# EasyEDA Pro project mini-link.eprj

# Schematic Schematic1
Create Date: 2022-12-03; Page Name: MCU; Project Name: GD32F103-DAP; Schematic Name: Schematic1; Update Date: 2023-03-23; Company: 嘉立创EDA; Page Size: A4; Version: V1.0
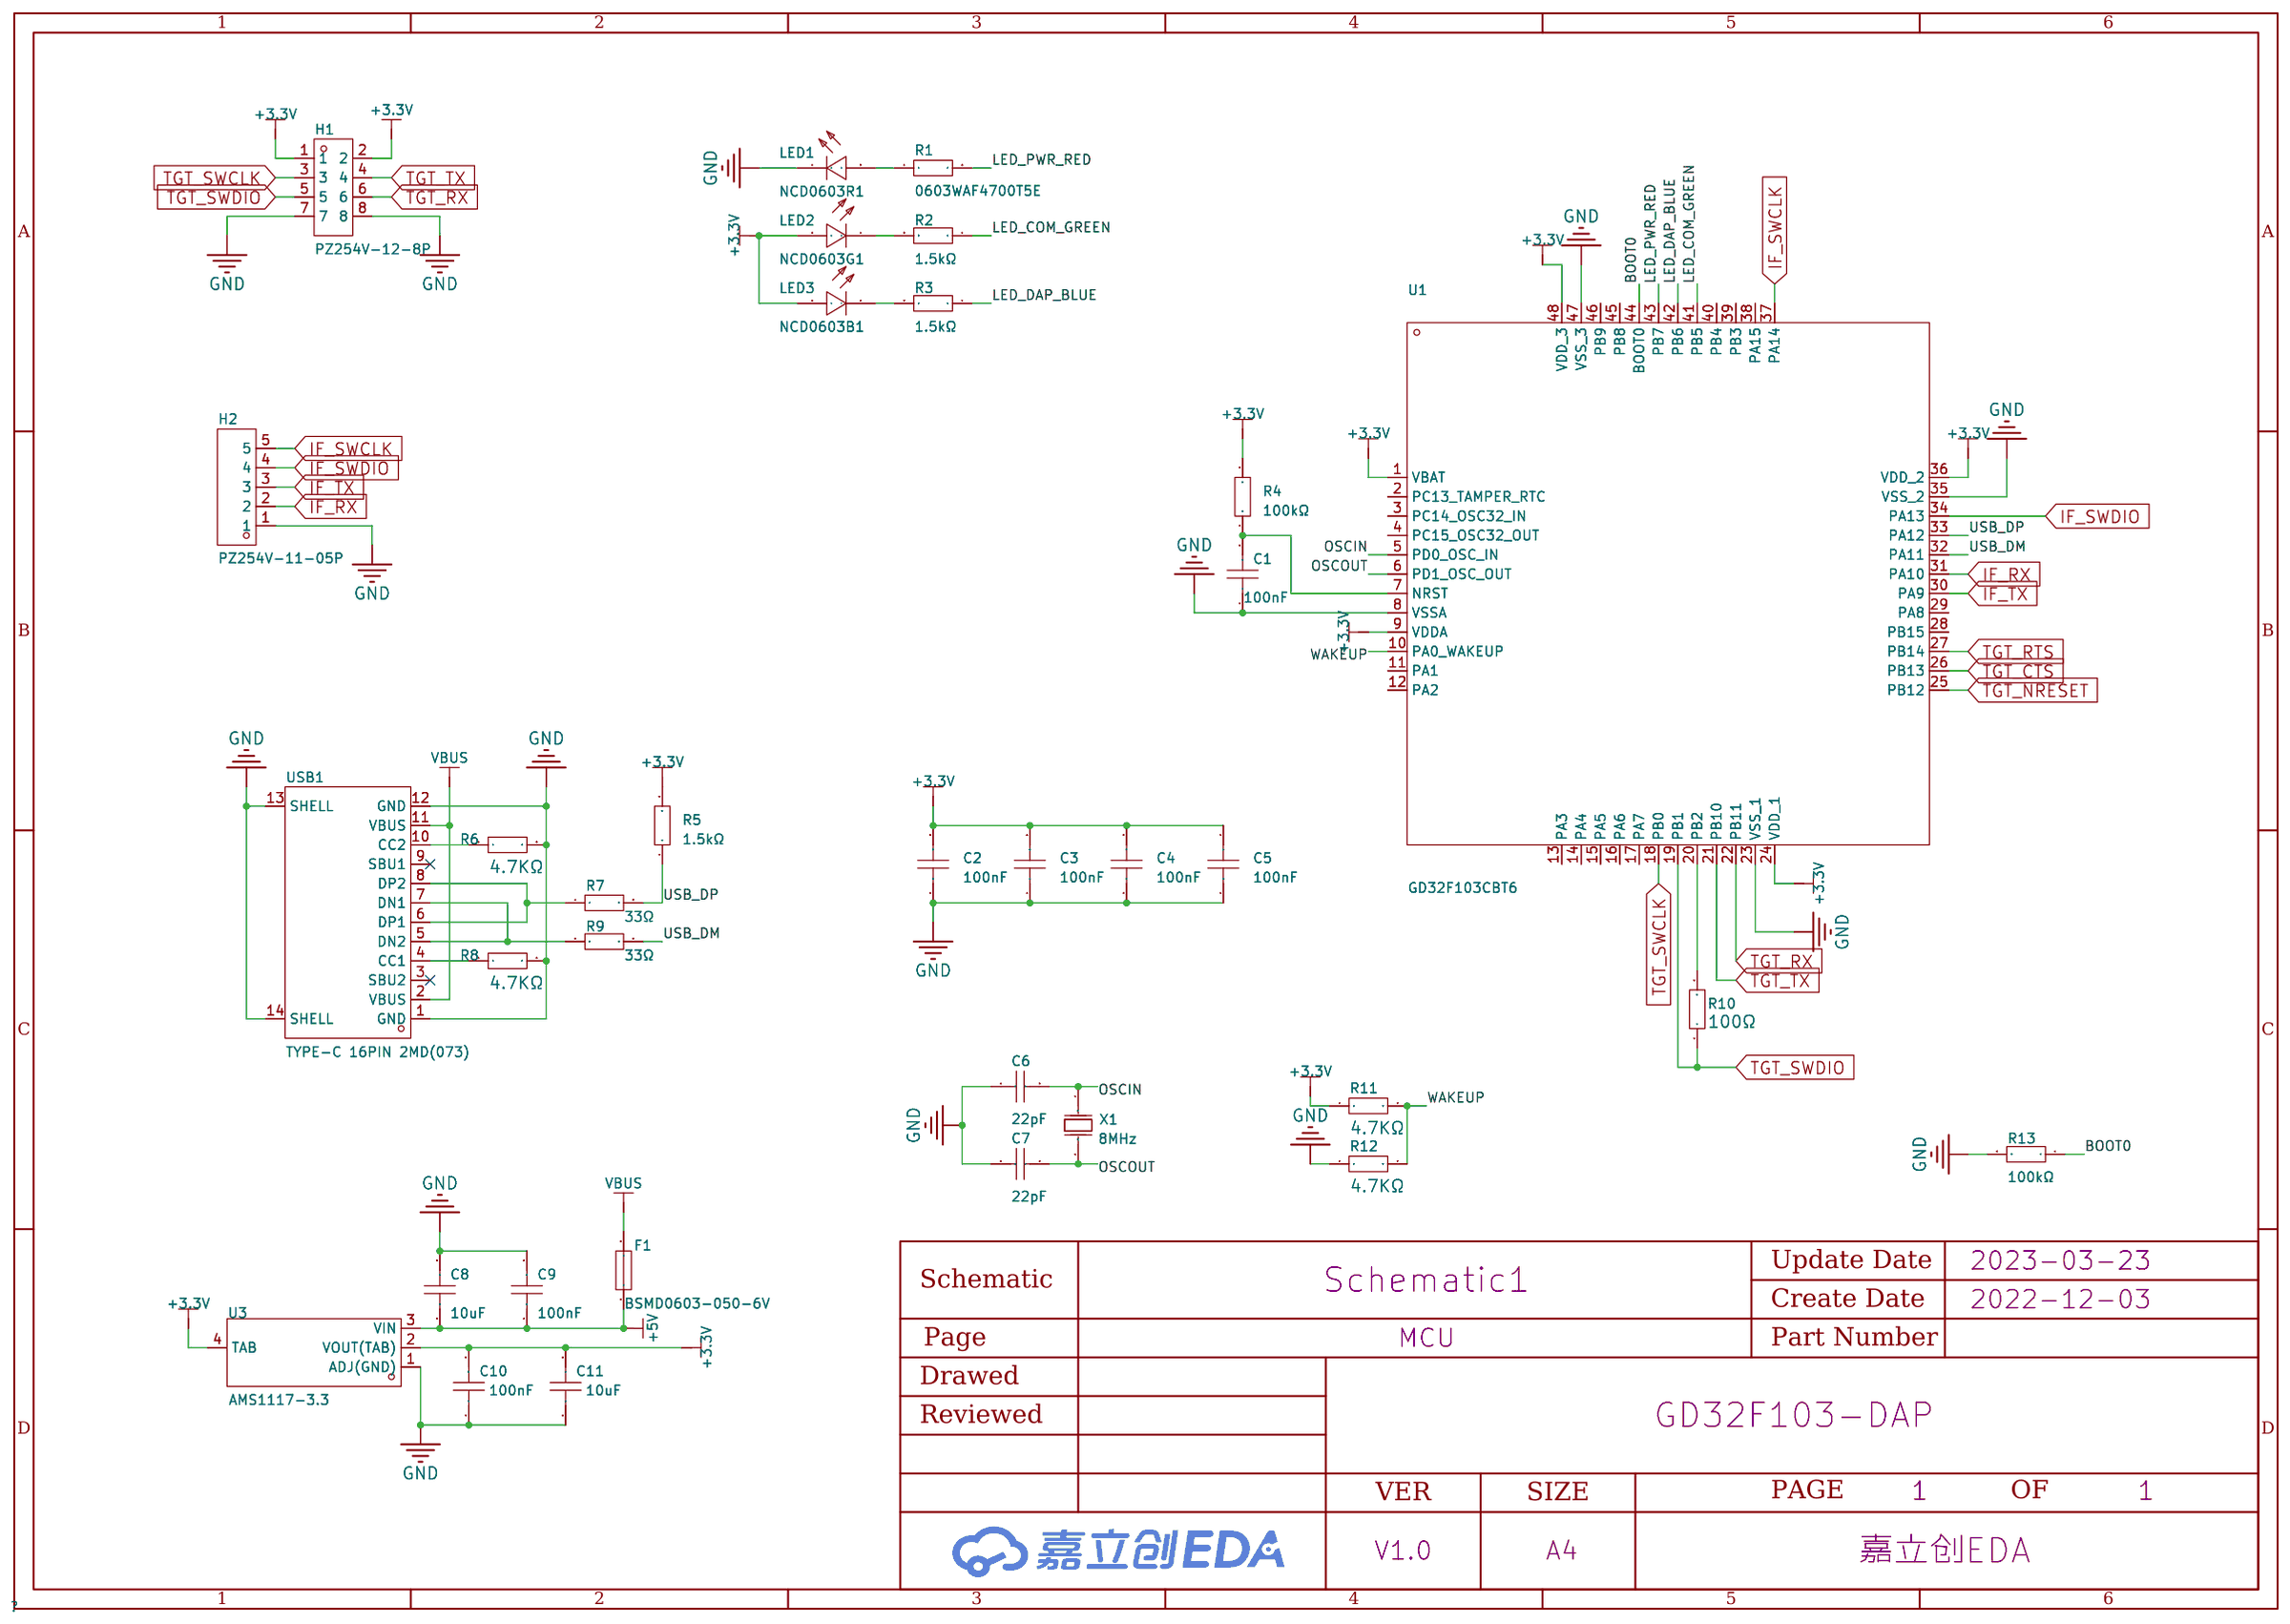
[diagram p0: schematic sheet]

## Parts
C1  100nF  [C0603]
C2  100nF  [C0603]
C3  100nF  [C0603]
C4  100nF  [C0603]
C5  100nF  [C0603]
C6  22pF  [C0603]
C7  22pF  [C0603]
C8  10uF  [C0603]
C9  100nF  [C0603]
C10  100nF  [C0603]
C11  10uF  [C0603]
F1  BSMD0603-050-6V  [F0603]
H1  PZ254V-12-8P  [HDR-TH_8P-P2.54-V-M-R2-C4-S2.54]
H2  PZ254V-11-05P  [HDR-TH_5P-P2.54-V-M]
LED1  NCD0603R1  [LED0603-RD_RED]
LED2  NCD0603G1  [LED0603-RD]
LED3  NCD0603B1  [LED0603-RD]
R1  470Ω  [R0603]
R2  1.5kΩ  [R0603]
R3  1.5kΩ  [R0603]
R4  100kΩ  [R0603]
R5  1.5kΩ  [R0603]
R6  4.7KΩ  [R0603]
R7  33Ω  [R0603]
R8  4.7KΩ  [R0603]
R9  33Ω  [R0603]
R10  100Ω  [R0603]
R11  4.7KΩ  [R0603]
R12  4.7KΩ  [R0603]
R13  100kΩ  [R0603]
U1  GD32F103CBT6  [LQFP-48_L7.0-W7.0-P0.50-LS9.0-BL]
U3  AMS1117-3.3  [SOT-223-4_L6.5-W3.5-P2.30-LS7.0-BR]
USB1  TYPE-C 16PIN 2MD(073)  [USB-C-SMD_TYPE-C-6PIN-2MD-073]
X1  8MHz  [CRYSTAL-SMD_L11.5-W4.8-LS12.7]

## Library data of the parts
C1-C5 C9 C10 = CC0603KRX7R9BB104: 容值:100nF;精度:±10%;额定电压:50V;材质(温度系数):X7R;; LCSC Part Name: 100nF ±10% 50V; Supplier Part: C14663; Manufacturer: YAGEO(国巨); Supplier Footprint: 0603; JLCPCB Part Class: Basic Part; Datasheet: https://atta.szlcsc.com/upload/public/pdf/source/20170116/1484561234239.pdf; Supplier: LCSC; Tolerance: ±10%; Voltage Rated: 50V; Temperature Coefficient: X7R
C6 C7 = CC0603JRNPO9BN220: 容值:22pF;精度:±5%;额定电压:50V;材质(温度系数):NP0;; LCSC Part Name: 22pF ±5% 50V; Supplier Part: C105620; Manufacturer: YAGEO(国巨); Supplier Footprint: 0603; JLCPCB Part Class: Extended Part; Datasheet: https://atta.szlcsc.com/upload/public/pdf/source/20170425/1493115771353.pdf; Supplier: LCSC; Tolerance: ±5%; Voltage Rated: 50V; Temperature Coefficient: NP0
C8 C11 = CL10A106KP8NNNC: 容值:10uF;精度:±10%;额定电压:10V;材质(温度系数):X5R;; LCSC Part Name: 10uF ±10% 10V; Supplier Part: C19702; Manufacturer: SAMSUNG(三星); Supplier Footprint: 0603; JLCPCB Part Class: Basic Part; Datasheet: https://atta.szlcsc.com/upload/public/pdf/source/20160103/1457707703378.pdf; Supplier: LCSC; Tolerance: ±10%; Voltage Rated: 10V; Temperature Coefficient: X5R
F1 = BSMD0603-050-6V: 最大电压:6V;最大电流:40A;保持电流:500mA;跳闸电流:1A;消耗功率:500mW;初始态阻值(最小值):100mΩ;跳断后阻值(最大值):800mΩ;最大动作时间:100ms;工作温度:-40~+85;; LCSC Part Name: 国产自恢复 0603 0.5A 6V; Supplier Part: C883095; Manufacturer: BHFUSE(佰宏); Supplier Footprint: 0603; JLCPCB Part Class: Extended Part; Datasheet: https://atta.szlcsc.com/upload/public/pdf/source/20220302/2A4AFA61964160B34367BDE2745D6217.pdf; Supplier: LCSC; Operating Voltage (Max): 6V; Current Rating (Max): 40A; Hold Current: 500mA; Trip Current: 1A; Power Dissipation: 500mW; Resistance - Initial (Ri) (Min): 100mΩ; Resistance - Post Trip (R1) (Max): 800mΩ; Maximum Time to Trip: 100ms; Operating Temperature: -40~+85
H1 = PZ254V-12-8P: 间距:2.54mm;总PIN位数:8;排数:2;插针结构:2x4P;行距:2.54mm;安装类型:直插;圆针/方针:方针;额定电流:-;额定电压:-;配合针长度:6mm;塑高:2.5mm;端接针长度:3mm;触头材质:黄铜;触头镀层:-;工作温度范围:-40~+105;颜色:黑色;; LCSC Part Name: 2.54mm 2x4P 直插 方针; Supplier Part: C492421; Manufacturer: XFCN(兴飞); Supplier Footprint: 直插,P=2.54mm; JLCPCB Part Class: Extended Part; Datasheet: https://atta.szlcsc.com/upload/public/pdf/source/20200309/C492421_DC8A206AF99CD7755BD4A5B0BC48200B.pdf; Supplier: LCSC; Pitch: 2.54mm; Number of Pins: 8; Number of Rows: 2; Pin Structure: 2x4P; Row Spacing: 2.54mm; Mounting Type: 直插; Circluar Pins/Square Pins: 方针; Length of Mating Pin: 6mm; Insulation Height: 2.5mm; Length of End Connection Pin: 3mm; Contact Material: 黄铜; Operating Temperature Range: -40~+105; Color: 黑色
H2 = PZ254V-11-05P: 间距:2.54mm;总PIN位数:5;排数:1;插针结构:1x5P;行距:-;安装类型:直插;圆针/方针:方针;额定电流:-;额定电压:-;配合针长度:6mm;塑高:2.5mm;端接针长度:3mm;触头材质:黄铜;触头镀层:-;工作温度范围:-40~+105;颜色:黑色;; LCSC Part Name: 2.54mm 1x5P 直插 方针; Supplier Part: C492404; Manufacturer: XFCN(兴飞); Supplier Footprint: 直插,P=2.54mm; JLCPCB Part Class: Extended Part; Datasheet: https://atta.szlcsc.com/upload/public/pdf/source/20200309/C492404_E51533260F8710EFF5D4617281164C1D.pdf; Supplier: LCSC; Pitch: 2.54mm; Number of Pins: 5; Number of Rows: 1; Pin Structure: 1x5P; Mounting Type: 直插; Circluar Pins/Square Pins: 方针; Length of Mating Pin: 6mm; Insulation Height: 2.5mm; Length of End Connection Pin: 3mm; Contact Material: 黄铜; Operating Temperature Range: -40~+105; Color: 黑色
LED1 = NCD0603R1_C84263: 发光颜色:红灯;; LCSC Part Name: 红灯; Supplier Part: C84263; Manufacturer: 国星光电; Supplier Footprint: 0603; JLCPCB Part Class: Extended Part; Datasheet: https://atta.szlcsc.com/upload/public/pdf/source/20200820/C84263_DABC6A75E58F576973B407FDBA283D60.pdf; Supplier: LCSC; Emitted Color: 红灯
LED2 = NCD0603G1: 发光颜色:翠绿;; LCSC Part Name: 翠绿; Supplier Part: C84267; Manufacturer: 国星光电; Supplier Footprint: 0603; JLCPCB Part Class: Extended Part; Datasheet: https://atta.szlcsc.com/upload/public/pdf/source/20200820/C84267_04BA7703640BAC111D09F5EFB971FBF3.pdf; Supplier: LCSC; Emitted Color: 翠绿
LED3 = NCD0603B1: 发光颜色:蓝灯;; LCSC Part Name: 蓝灯; Supplier Part: C84266; Manufacturer: 国星光电; Supplier Footprint: 0603; JLCPCB Part Class: Extended Part; Datasheet: https://atta.szlcsc.com/upload/public/pdf/source/20200820/C84266_6A3CDBEFA72C6CAD68EDA53474ADAE6C.pdf; Supplier: LCSC; Emitted Color: 蓝灯
R1 = 0603WAF4700T5E: 电阻类型:厚膜电阻;阻值:470Ω;精度:±1%;功率:100mW;温度系数:±100ppm/;最大工作电压:75V;工作温度范围:-55~+155;; LCSC Part Name: 470Ω(4700) ±1% 编带; Supplier Part: C23179; Manufacturer: UNI-ROYAL(厚声); Supplier Footprint: 0603; JLCPCB Part Class: Basic Part; Datasheet: https://atta.szlcsc.com/upload/public/pdf/source/20170920/C23179_1505901118208982562.pdf; Supplier: LCSC; Type: 厚膜电阻; Tolerance: ±1%; Power(Watts): 100mW; Temperature Coefficient: ±100ppm/; Overload Voltage (Max): 75V; Operating Temperature Range: -55~+155
R2 R3 R5 = 0603WAF1501T5E: 阻值:1.5kΩ;精度:±1%;温度系数:±100ppm/;功率:1/10W;最大工作电压:75V;工作温度范围:-55~+155;; LCSC Part Name: 1.5KΩ ±1%; Supplier Part: C22843; Manufacturer: UNI-ROYAL(厚声); Supplier Footprint: 0603; JLCPCB Part Class: Basic Part; Datasheet: https://atta.szlcsc.com/upload/public/pdf/source/20170920/C22843_1505887489783980640.pdf; Supplier: LCSC; Tolerance: ±1%; Temperature Coefficient: ±100ppm/; Power(Watts): 1/10W; Overload Voltage (Max): 75V; Operating Temperature Range: -55~+155
R4 R13 = 0603WAF1003T5E: 电阻类型:厚膜电阻;阻值:100kΩ;精度:±1%;功率:100mW;温度系数:±100ppm/;最大工作电压:75V;工作温度范围:-55~+155;; LCSC Part Name: 100kΩ ±1% 100mW; Supplier Part: C25803; Manufacturer: UNI-ROYAL(厚声); Supplier Footprint: 0603; JLCPCB Part Class: Basic Part; Datasheet: https://atta.szlcsc.com/upload/public/pdf/source/20200306/C422600_1E6D84923E4A46A82E41ADD87F860B5C.pdf; Supplier: LCSC; Type: 厚膜电阻; Tolerance: ±1%; Power(Watts): 100mW; Temperature Coefficient: ±100ppm/; Overload Voltage (Max): 75V; Operating Temperature Range: -55~+155
R6 R8 R11 R12 = 0603WAF4701T5E: LCSC Part Name: 4.7KΩ(4701) ±1% 编带; Supplier Part: C23162; Manufacturer: UNI-ROYAL(厚声); Supplier Footprint: 0603; JLCPCB Part Class: Basic Part; Datasheet: https://atta.szlcsc.com/upload/public/pdf/source/20170920/C23162_1505901109673982545.pdf; Supplier: LCSC
R7 R9 = 0603WAF330JT5E: 电阻类型:厚膜电阻;阻值:33Ω;精度:±1%;功率:1/10W;温度系数:±100ppm/;最大工作电压:75V;工作温度范围:-55~+155;; LCSC Part Name: 33Ω ±1% 1/10W; Supplier Part: C23140; Manufacturer: UNI-ROYAL(厚声); Supplier Footprint: 0603; JLCPCB Part Class: Basic Part; Datasheet: https://atta.szlcsc.com/upload/public/pdf/source/20200306/C422600_1E6D84923E4A46A82E41ADD87F860B5C.pdf; Supplier: LCSC; Type: 厚膜电阻; Tolerance: ±1%; Power(Watts): 1/10W; Temperature Coefficient: ±100ppm/; Overload Voltage (Max): 75V; Operating Temperature Range: -55~+155
R10 = 0603WAF1000T5E: LCSC Part Name: 100Ω(1000) ±1% 编带; Supplier Part: C22775; Manufacturer: UNI-ROYAL(厚声); Supplier Footprint: 0603; JLCPCB Part Class: Basic Part; Datasheet: https://atta.szlcsc.com/upload/public/pdf/source/20170920/C22775_1505887458160980573.pdf; Supplier: LCSC
U1 = GD32F103CBT6: CPU内核:ARM Cortex-M3;CPU最大主频:108MHz;工作电压范围:2.6V~3.6V;内部振荡器:有;外部时钟频率范围:3MHz~32MHz;程序 FLASH容量:128KB;RAM总容量:20KB;EEPROM/数据 FLASH容量:-;GPIO端口数量:37;ADC(单元数/通道数/位数):2@x12bit;DAC(单元数/通道数/位数):-;(E)PWM(单元数/通道数/位数):1@x16bit;8位Timer数量:-;16位Timer数量:3;32位Timer数量:-;内部比较器; Supplier Part: C77979; Manufacturer: GigaDevice(兆易创新); Supplier Footprint: LQFP-48_7x7x05P; JLCPCB Part Class: Extended Part; Datasheet: https://atta.szlcsc.com/upload/public/pdf/source/20160910/1473490275421.pdf; Supplier: LCSC; CPU Core: ARM Cortex-M3; Maximum Frequency: 108MHz; Supply Voltage Range: 2.6V~3.6V; Internal Oscillator: 有; External Clock Frequency Rang: 3MHz~32MHz; Program FLASH Size: 128KB; RAM Size: 20KB; GPIO Ports Number: 37; ADC (Units/Channels/bits): 2@x12bit; (E)PWM (Units/Channels/bits): 1@x16bit; 16Bit Timer Number: 3; U(S)ART Number: 3; I2C Number: 2; (Q)SPI Number: 2; CAN Number: 1; USB (H/D/OTG): 全速USB Device; Peripherals / Functions / Protocol Stacks: 片载温度传感器；DMA；看门狗；LIN总线协议；PWM；IrDA；SDIO；RTC实时时钟; Operating Temperature Range: -40~+85
U3 = AMS1117-3.3_C347222: 输出类型:固定;输出极性:正;输出通道数:1;最大输入电压:18V;输出电压:3.3V;压差:1.3V@(1A);输出电流:1A;电源纹波抑制比(PSRR):60dB@(120Hz);; LCSC Part Name: 正 Vin=18V Vout=3.3V 1A 60dB@(120Hz); Supplier Part: C347222; Manufacturer: UMW(广东友台半导体); Supplier Footprint: SOT-223-4; JLCPCB Part Class: Extended Part; Datasheet: https://atta.szlcsc.com/upload/public/pdf/source/20211011/50CC665C22E3A66C08379A4A74BDA25C.pdf; Supplier: LCSC; Output Type: 固定; Output Polarity: 正; Number of Outputs: 1; Maximum Input Voltage: 18V; Output Voltage: 3.3V; Dropout Voltage: 1.3V@(1A); Output Current: 1A; Power Supply Rejection Ratio (PRSS): 60dB@(120Hz); Power Supply Rejection Ratio (PSRR): 60dB@(120Hz)
USB1 = TYPE-C 16PIN 2MD(073): 连接器类型:Type-C;标准:-;公母:母座;触点数量:16;端口数量:1;安装方式:卧贴;额定电流 - 电源:5A;工作温度范围:-25~+85;; LCSC Part Name: Type-C 母座 卧贴 带定位柱 不锈钢外壳 2次模顶; Supplier Part: C2765186; Manufacturer: SHOU HAN(首韩); Supplier Footprint: SMD; JLCPCB Part Class: Extended Part; Datasheet: https://atta.szlcsc.com/upload/public/pdf/source/20211123/39B17C16241EAC15C5E277BDA434118E.pdf; Supplier: LCSC; Connector Type: Type-C; Gender: 母座; Number of Contacts: 16; Number of Ports: 1; Mounting Style: 卧贴; Current Rating - Power (Max): 5A; Operating Temperature Range: -25~+85
X1 = X49SM8MSD2SC: 晶振类型:49SMD;频率:8MHz;频率公差:±20ppm;频率稳定度:±30ppm;负载电容:20pF;工作温度:-20℃~+70℃;; LCSC Part Name: HC-49SMD 8MHz ±20ppm 20pF; Supplier Part: C12674; Manufacturer: YXC(扬兴晶振); Supplier Footprint: HC-49S-SMD-2P; JLCPCB Part Class: Basic Part; Datasheet: https://atta.szlcsc.com/upload/public/pdf/source/20210329/C106809_0E91E60850A780B284B63D653DC40EA4.pdf; Supplier: LCSC; Crystal Type: 49SMD; Frequency Tolerance: ±20ppm; Frequency Stability: ±30ppm; Load Capacitance: 20pF; Operating Temperature: -20℃~+70℃

## Nets
+3.3V: C2.2 C3.2 C4.2 C5.2 C10.2 C11.2 H1.1 H1.2 LED2.2(A) LED3.2(+) R4.2 R5.2 R11.1 U1.1(VBAT) U1.9(VDDA) U1.24(VDD_1) U1.36(VDD_2) U1.48(VDD_3) U3.2(VOUT(TAB)) U3.4(TAB)
+5V: C8.1 C9.1 F1.1 U3.3(VIN)
GND: C1.1 C2.1 C3.1 C4.1 C5.1 C6.1 C7.1 C8.2 C9.2 C10.1 C11.1 H1.7 H1.8 H2.1 LED1.1(K) R6.2 R8.2 R12.1 R13.2 U1.8(VSSA) U1.23(VSS_1) U1.35(VSS_2) U1.47(VSS_3) U3.1(ADJ(GND)) USB1.1(GND) USB1.12(GND) USB1.13(SHELL) USB1.14(SHELL)
VBUS: F1.2 USB1.2(VBUS) USB1.11(VBUS)
BOOT0: R13.1 U1.44(BOOT0)
IF_RX: H2.2 U1.31(PA10)
IF_SWCLK: H2.5 U1.37(PA14)
IF_SWDIO: H2.4 U1.34(PA13)
IF_TX: H2.3 U1.30(PA9)
LED_COM_GREEN: R2.1 U1.41(PB5)
LED_DAP_BLUE: R3.1 U1.42(PB6)
LED_PWR_RED: R1.2 U1.43(PB7)
OSCIN: C6.2 U1.5(PD0_OSC_IN) X1.1(OSC1)
OSCOUT: C7.2 U1.6(PD1_OSC_OUT) X1.2(OSC2)
TGT_CTS: U1.26(PB13)
TGT_NRESET: U1.25(PB12)
TGT_RTS: U1.27(PB14)
TGT_RX: H1.6 U1.22(PB11)
TGT_SWCLK: H1.3 U1.18(PB0)
TGT_SWDIO: H1.5 R10.1 U1.19(PB1)
TGT_TX: H1.4 U1.21(PB10)
USB_DM: R9.2 U1.32(PA11)
USB_DP: R5.1 R7.2 U1.33(PA12)
WAKEUP: R11.2 R12.2 U1.10(PA0_WAKEUP)
$1N5011: R6.1 USB1.10(CC2)
$1N5022: R8.1 USB1.4(CC1)
$1N5569: R7.1 USB1.6(DP1) USB1.8(DP2)
$1N5606: R9.1 USB1.5(DN2) USB1.7(DN1)
$1N7368: R10.2 U1.20(PB2)
$1N11980: C1.2 R4.1 U1.7(NRST)
$1N15971: LED1.2(A) R1.1
$1N16162: LED2.1(K) R2.2
$1N16361: LED3.1(-) R3.2

Not connected (* = marked no-connect by the designer): U1 2(PC13_TAMPER_RTC) 3(PC14_OSC32_IN) 4(PC15_OSC32_OUT) 11(PA1) 12(PA2) 13(PA3) 14(PA4) 15(PA5) 16(PA6) 17(PA7) 28(PB15) 29(PA8) 38(PA15) 39(PB3) 40(PB4) 45(PB8) 46(PB9); USB1 3(SBU2)* 9(SBU1)*

# Schematic Schematic2
Create Date: 2023-01-11; Page Name: MCU; Project Name: GD32F103-DAP; Schematic Name: Schematic2; Update Date: 2023-01-30; Company: 嘉立创EDA; Page Size: A4; Version: V1.0
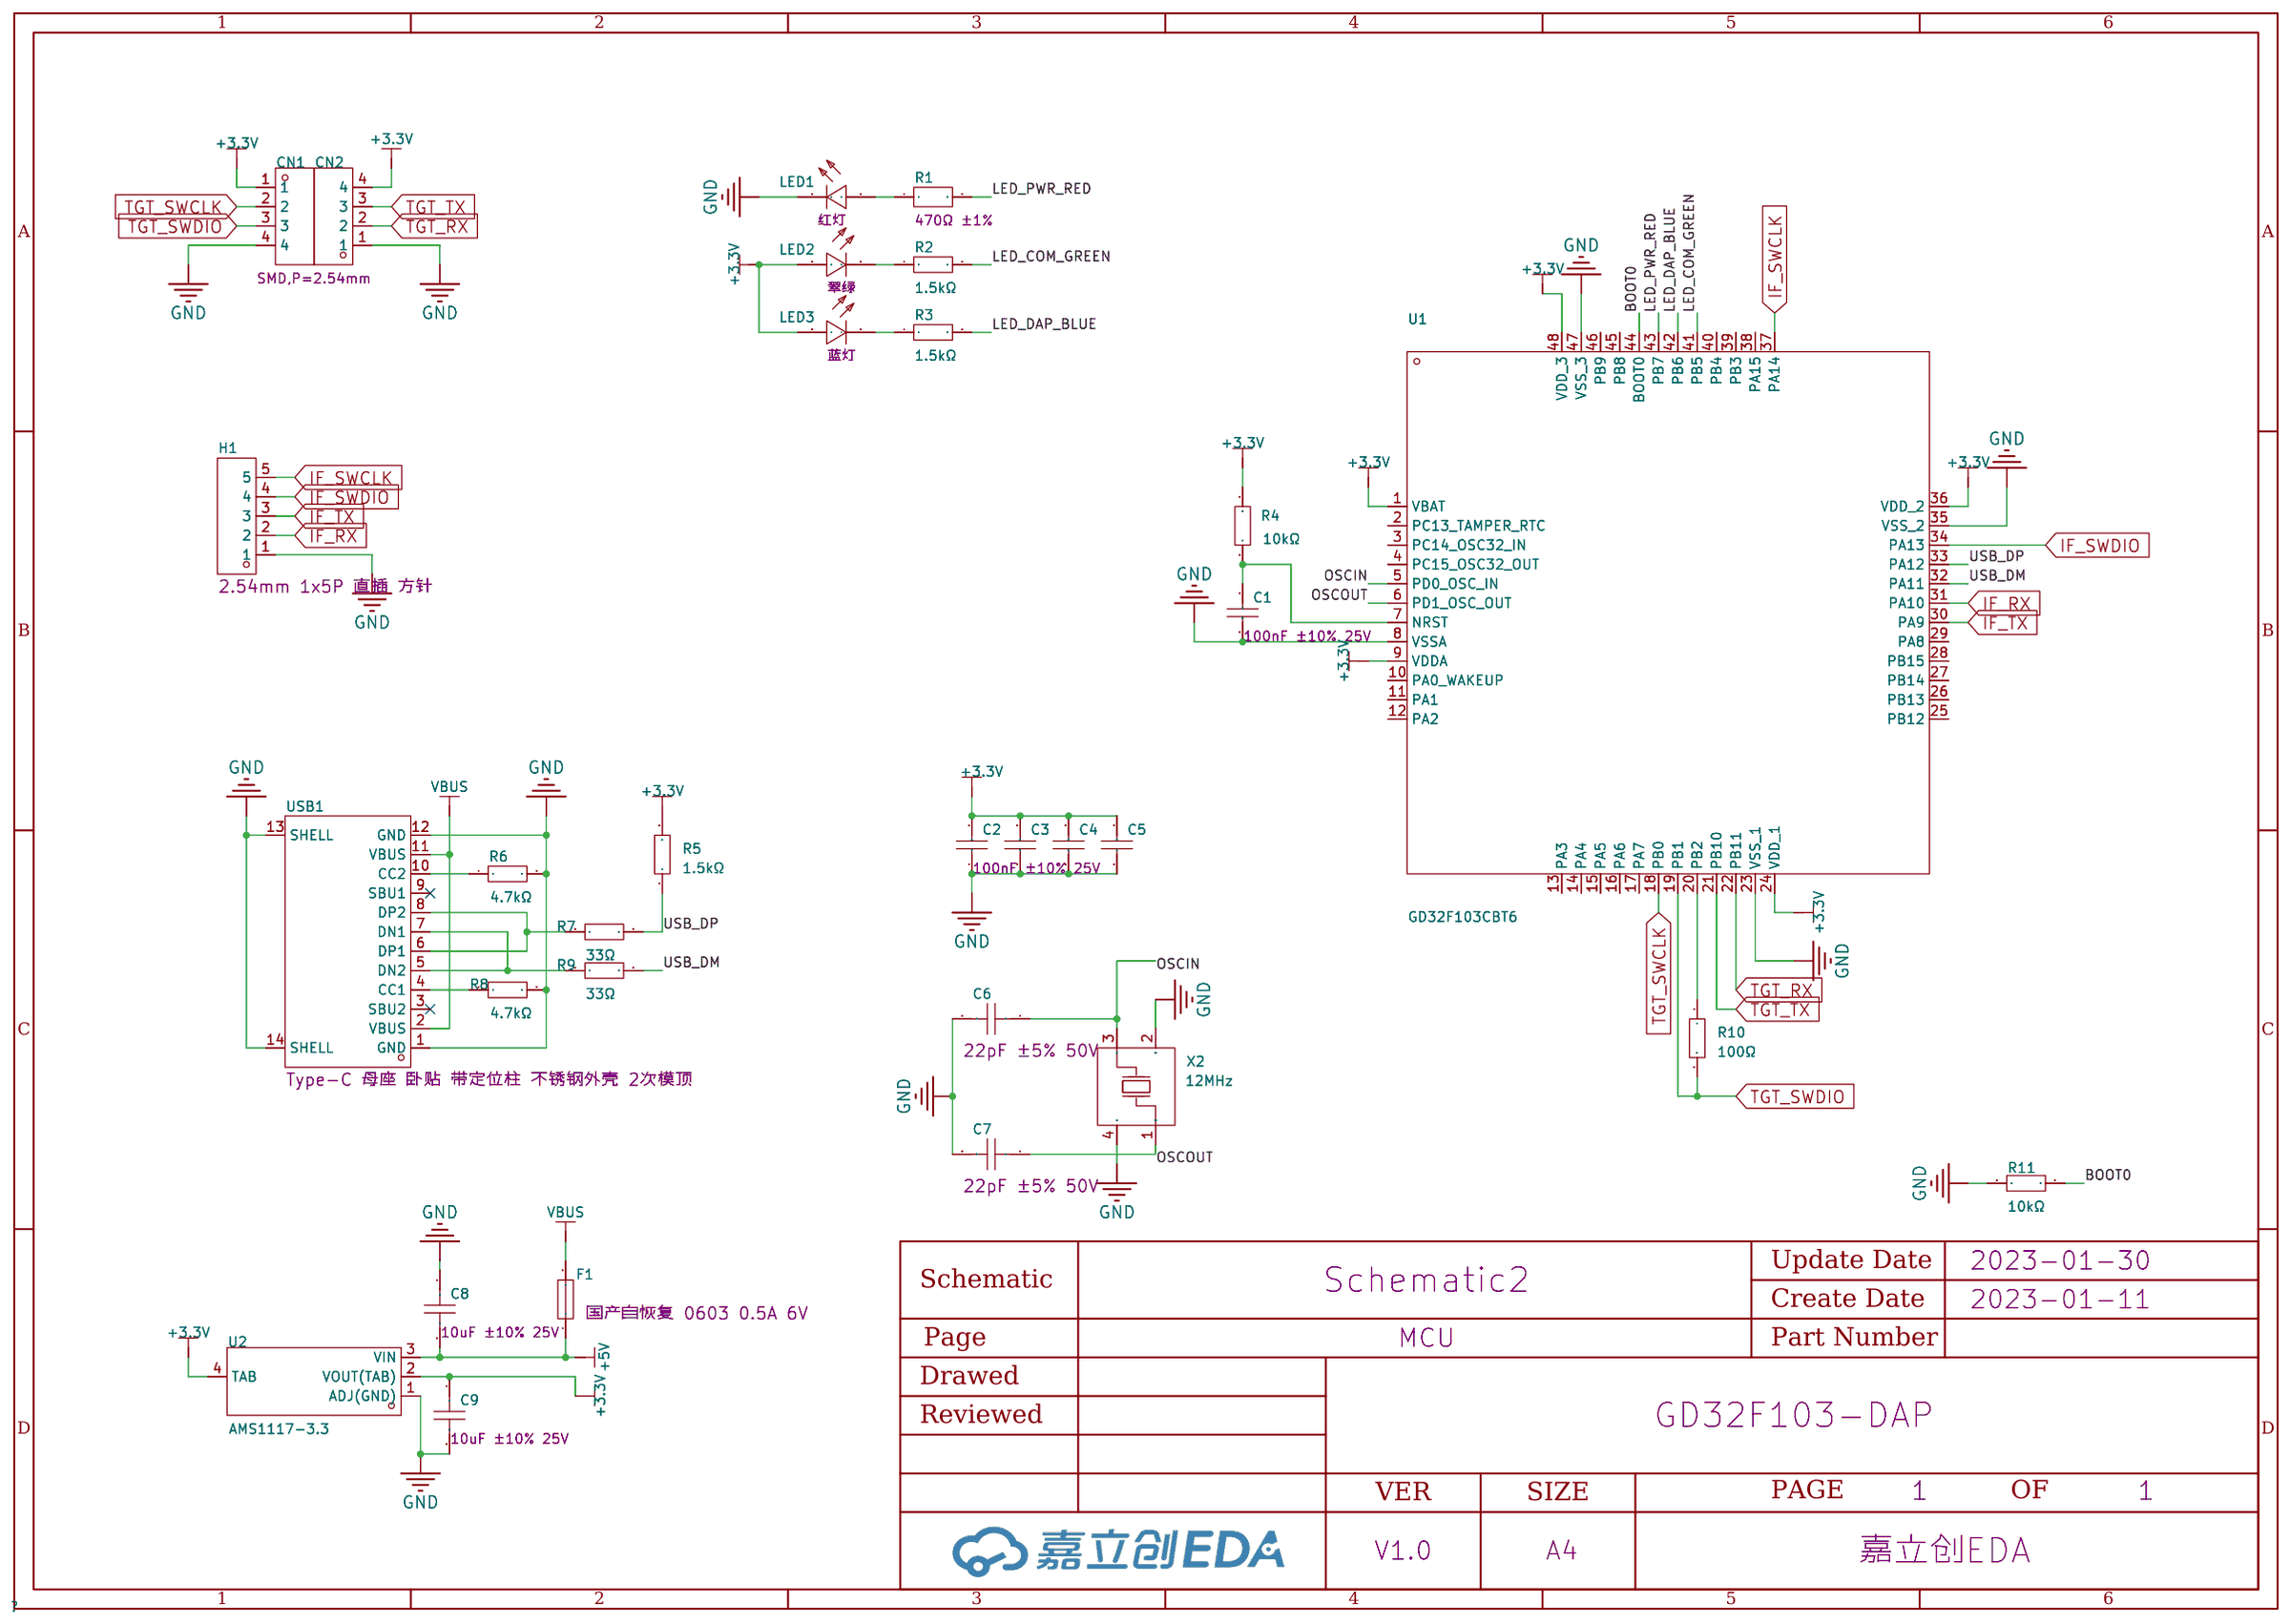
[diagram p1: schematic sheet]

## Parts
C1  100nF  [C0201]
C2  100nF  [C0201]
C3  100nF  [C0201]
C4  100nF  [C0201]
C5  100nF  [C0201]
C6  22pF  [C0201]
C7  22pF  [C0201]
C8  10uF  [C0603]
C9  10uF  [C0603]
CN1  1125-1104G0Z135CR01  [CONN-SMD_1125-1104G0Z135CR01]
CN2  1125-1104G0Z135CR01  [CONN-SMD_1125-1104G0Z135CR01]
F1  BSMD0603-050-6V  [F0603]
H1  PZ254V-11-05P  [HDR-TH_5P-P2.54-V-M]
LED1  NCD0603R1  [LED0603-RD_RED]
LED2  NCD0603G1  [LED0603-RD]
LED3  NCD0603B1  [LED0603-RD]
R1  0201WMF4700TEE  [R0201]
R2  1.5kΩ  [R0201]
R3  1.5kΩ  [R0201]
R4  10kΩ  [R0201]
R5  1.5kΩ  [R0201]
R6  4.7kΩ  [R0201]
R7  33Ω  [R0201]
R8  4.7kΩ  [R0201]
R9  33Ω  [R0201]
R10  100Ω  [R0201]
R11  10kΩ  [R0201]
U1  GD32F103CBT6  [LQFP-48_L7.0-W7.0-P0.50-LS9.0-BL]
U2  AMS1117-3.3  [SOT-223-4_L6.5-W3.5-P2.30-LS7.0-BR]
USB1  TYPE-C 16PIN 2MD(073)  [USB-C-SMD_TYPE-C-6PIN-2MD-073]
X2  12MHz  [OSC-SMD_4P-L3.2-W2.5-BL]

## Library data of the parts
C1-C5 = GRM033R61E104KE14D: 容值:100nF;精度:±10%;额定电压:25V;材质(温度系数):X5R;; LCSC Part Name: 100nF ±10% 25V; Supplier Part: C76939; Manufacturer: muRata(村田); Supplier Footprint: 0201; JLCPCB Part Class: Extended Part; Datasheet: https://atta.szlcsc.com/upload/public/pdf/source/20180307/C76939_15204091018551407727.pdf; Supplier: LCSC; Tolerance: ±10%; Voltage Rated: 25V; Temperature Coefficient: X5R
C6 C7 = CC0201JRNPO9BN220: 容值:22pF;精度:±5%;额定电压:50V;材质(温度系数):NP0;; LCSC Part Name: 22pF ±5% 50V; Supplier Part: C272881; Manufacturer: YAGEO(国巨); Supplier Footprint: 0201; JLCPCB Part Class: Extended Part; Datasheet: https://atta.szlcsc.com/upload/public/pdf/source/20180820/C272881_2D3730AA9A71748A0E9B09862C637263.pdf; Supplier: LCSC; Tolerance: ±5%; Voltage Rated: 50V; Temperature Coefficient: NP0
C8 C9 = GRM188R61E106KA73D: 容值:10uF;精度:±10%;额定电压:25V;材质(温度系数):X5R;; LCSC Part Name: 10uF ±10% 25V; Supplier Part: C344022; Manufacturer: muRata(村田); Supplier Footprint: 0603; JLCPCB Part Class: Extended Part; Datasheet: https://atta.szlcsc.com/upload/public/pdf/source/20181211/C344022_BB98D43E7DA95E5A749FBFE073C8A3E0.pdf; Supplier: LCSC; Tolerance: ±10%; Voltage Rated: 25V; Temperature Coefficient: X5R
CN1 CN2 = 1125-1104G0Z135CR01: 间距:2.54mm;总PIN位数:4;排数:1;插针结构:1x4P;行距:-;安装类型:卧贴;圆针/方针:方针;额定电流:3A;额定电压:-;配合针长度:6mm;塑高:2.5mm;端接针长度:-;工作温度范围:-40℃~+105℃;颜色:黑色;; LCSC Part Name: 2.54mm 1x4P; Supplier Part: C721862; Manufacturer: Wcon(维峰电子); Supplier Footprint: SMD,P=2.54mm; JLCPCB Part Class: Extended Part; Datasheet: https://atta.szlcsc.com/upload/public/pdf/source/20200814/C721858_065EF9A46C6CEDE5E49F8CC6A7E28DB2.pdf; Supplier: LCSC; Pitch: 2.54mm; Number of Pins: 4; Number of Rows: 1; Pin Structure: 1x4P; Mounting Type: 卧贴; Circluar Pins/Square Pins: 方针; Current Rating (Max): 3A; Length of Mating Pin: 6mm; Insulation Height: 2.5mm; Operating Temperature Range: -40℃~+105℃; Color: 黑色
F1 = BSMD0603-050-6V: 最大电压:6V;最大电流:40A;保持电流:500mA;跳闸电流:1A;消耗功率:500mW;初始态阻值(最小值):100mΩ;跳断后阻值(最大值):800mΩ;最大动作时间:100ms;工作温度:-40~+85;; LCSC Part Name: 国产自恢复 0603 0.5A 6V; Supplier Part: C883095; Manufacturer: BHFUSE(佰宏); Supplier Footprint: 0603; JLCPCB Part Class: Extended Part; Datasheet: https://atta.szlcsc.com/upload/public/pdf/source/20220302/2A4AFA61964160B34367BDE2745D6217.pdf; Supplier: LCSC; Operating Voltage (Max): 6V; Current Rating (Max): 40A; Hold Current: 500mA; Trip Current: 1A; Power Dissipation: 500mW; Resistance - Initial (Ri) (Min): 100mΩ; Resistance - Post Trip (R1) (Max): 800mΩ; Maximum Time to Trip: 100ms; Operating Temperature: -40~+85
H1 = PZ254V-11-05P: 间距:2.54mm;总PIN位数:5;排数:1;插针结构:1x5P;行距:-;安装类型:直插;圆针/方针:方针;额定电流:-;额定电压:-;配合针长度:6mm;塑高:2.5mm;端接针长度:3mm;触头材质:黄铜;触头镀层:-;工作温度范围:-40~+105;颜色:黑色;; LCSC Part Name: 2.54mm 1x5P 直插 方针; Supplier Part: C492404; Manufacturer: XFCN(兴飞); Supplier Footprint: 直插,P=2.54mm; JLCPCB Part Class: Extended Part; Datasheet: https://atta.szlcsc.com/upload/public/pdf/source/20200309/C492404_E51533260F8710EFF5D4617281164C1D.pdf; Supplier: LCSC; Pitch: 2.54mm; Number of Pins: 5; Number of Rows: 1; Pin Structure: 1x5P; Mounting Type: 直插; Circluar Pins/Square Pins: 方针; Length of Mating Pin: 6mm; Insulation Height: 2.5mm; Length of End Connection Pin: 3mm; Contact Material: 黄铜; Operating Temperature Range: -40~+105; Color: 黑色
LED1 = NCD0603R1_C84263: 发光颜色:红灯;; LCSC Part Name: 红灯; Supplier Part: C84263; Manufacturer: 国星光电; Supplier Footprint: 0603; JLCPCB Part Class: Extended Part; Datasheet: https://atta.szlcsc.com/upload/public/pdf/source/20200820/C84263_DABC6A75E58F576973B407FDBA283D60.pdf; Supplier: LCSC; Emitted Color: 红灯
LED2 = NCD0603G1: 发光颜色:翠绿;; LCSC Part Name: 翠绿; Supplier Part: C84267; Manufacturer: 国星光电; Supplier Footprint: 0603; JLCPCB Part Class: Extended Part; Datasheet: https://atta.szlcsc.com/upload/public/pdf/source/20200820/C84267_04BA7703640BAC111D09F5EFB971FBF3.pdf; Supplier: LCSC; Emitted Color: 翠绿
LED3 = NCD0603B1: 发光颜色:蓝灯;; LCSC Part Name: 蓝灯; Supplier Part: C84266; Manufacturer: 国星光电; Supplier Footprint: 0603; JLCPCB Part Class: Extended Part; Datasheet: https://atta.szlcsc.com/upload/public/pdf/source/20200820/C84266_6A3CDBEFA72C6CAD68EDA53474ADAE6C.pdf; Supplier: LCSC; Emitted Color: 蓝灯
R1 = 0201WMF4700TEE: 阻值:470Ω;精度:±1%;温度系数:±200ppm/℃;温度系数:±200ppm/℃;功率:0.05W;; LCSC Part Name: 470Ω ±1%; Supplier Part: C473464; Manufacturer: UNI-ROYAL(厚声); Supplier Footprint: 0201; JLCPCB Part Class: Extended Part; Datasheet: https://atta.szlcsc.com/upload/public/pdf/source/20191223/C473464_B2EF0D56F7B8A8290861F6290257834A.pdf; Supplier: LCSC
R2 R3 R5 = RC0201FR-071K5L: 电阻类型:厚膜电阻;阻值:1.5kΩ;精度:±1%;功率:50mW;温度系数:±200ppm/℃;最大工作电压:25V;工作温度范围:-55℃~+125℃;; LCSC Part Name: 1.5kΩ ±1% 50mW; Supplier Part: C155737; Manufacturer: YAGEO(国巨); Supplier Footprint: 0201; JLCPCB Part Class: Extended Part; Datasheet: https://atta.szlcsc.com/upload/public/pdf/source/20201110/C155737_E25239ED5E88A0AF1E57A19FB1EAD594.pdf; Supplier: LCSC; Type: 厚膜电阻; Tolerance: ±1%; Power(Watts): 50mW; Temperature Coefficient: ±200ppm/℃; Overload Voltage (Max): 25V; Operating Temperature Range: -55℃~+125℃
R4 R11 = RC0201FR-0710KL: 电阻类型:厚膜电阻;阻值:10kΩ;精度:±1%;功率:50mW;温度系数:±200ppm/℃;最大工作电压:25V;工作温度范围:-55℃~+125℃;; LCSC Part Name: 10kΩ ±1% 50mW; Supplier Part: C106225; Manufacturer: YAGEO(国巨); Supplier Footprint: 0201; JLCPCB Part Class: Extended Part; Datasheet: https://atta.szlcsc.com/upload/public/pdf/source/20171221/C106225_15138309973201195185.pdf; Supplier: LCSC; Type: 厚膜电阻; Tolerance: ±1%; Power(Watts): 50mW; Temperature Coefficient: ±200ppm/℃; Overload Voltage (Max): 25V; Operating Temperature Range: -55℃~+125℃
R6 R8 = RC0201FR-074K7L: 阻值:4.7kΩ;精度:±1%;功率:50mW;温度系数:±200ppm/℃;最大工作电压:25V;工作温度范围:-55℃~+125℃;; LCSC Part Name: 4.7kΩ ±1% 50mW; Supplier Part: C138135; Manufacturer: YAGEO(国巨); Supplier Footprint: 0201; JLCPCB Part Class: Extended Part; Datasheet: https://atta.szlcsc.com/upload/public/pdf/source/20171107/C138135_15100517132301097032.pdf; Supplier: LCSC; Tolerance: ±1%; Power(Watts): 50mW; Temperature Coefficient: ±200ppm/℃; Overload Voltage (Max): 25V; Operating Temperature Range: -55℃~+125℃
R7 R9 = RC0201FR-0733RL: 电阻类型:厚膜电阻;阻值:33Ω;精度:±1%;功率:50mW;温度系数:±200ppm/℃;最大工作电压:25V;工作温度范围:-55℃~+155℃;; LCSC Part Name: 33Ω ±1% 50mW; Supplier Part: C295794; Manufacturer: YAGEO(国巨); Supplier Footprint: 0201; JLCPCB Part Class: Extended Part; Datasheet: https://atta.szlcsc.com/upload/public/pdf/source/20180921/C295794_AC67CF106F2E138B206E2AC95FE186AF.pdf; Supplier: LCSC; Type: 厚膜电阻; Tolerance: ±1%; Power(Watts): 50mW; Temperature Coefficient: ±200ppm/℃; Overload Voltage (Max): 25V; Operating Temperature Range: -55℃~+155℃
R10 = 0201WMF1000TEE: 电阻类型:厚膜电阻;阻值:100Ω;精度:±1%;功率:50mW;温度系数:±200ppm/℃;最大工作电压:25V;工作温度范围:-55℃~+155℃;; LCSC Part Name: 100Ω ±1% 50mW; Supplier Part: C270366; Manufacturer: UNI-ROYAL(厚声); Supplier Footprint: 0201; JLCPCB Part Class: Extended Part; Datasheet: https://atta.szlcsc.com/upload/public/pdf/source/20200306/C422600_1E6D84923E4A46A82E41ADD87F860B5C.pdf; Supplier: LCSC; Type: 厚膜电阻; Tolerance: ±1%; Power(Watts): 50mW; Temperature Coefficient: ±200ppm/℃; Overload Voltage (Max): 25V; Operating Temperature Range: -55℃~+155℃
U1 = GD32F103CBT6: CPU内核:ARM Cortex-M3;CPU最大主频:108MHz;工作电压范围:2.6V~3.6V;内部振荡器:有;外部时钟频率范围:3MHz~32MHz;程序 FLASH容量:128KB;RAM总容量:20KB;EEPROM/数据 FLASH容量:-;GPIO端口数量:37;ADC(单元数/通道数/位数):2@x12bit;DAC(单元数/通道数/位数):-;(E)PWM(单元数/通道数/位数):1@x16bit;8位Timer数量:-;16位Timer数量:3;32位Timer数量:-;内部比较器; Supplier Part: C77979; Manufacturer: GigaDevice(兆易创新); Supplier Footprint: LQFP-48_7x7x05P; JLCPCB Part Class: Extended Part; Datasheet: https://atta.szlcsc.com/upload/public/pdf/source/20160910/1473490275421.pdf; Supplier: LCSC; CPU Core: ARM Cortex-M3; Maximum Frequency: 108MHz; Supply Voltage Range: 2.6V~3.6V; Internal Oscillator: 有; External Clock Frequency Rang: 3MHz~32MHz; Program FLASH Size: 128KB; RAM Size: 20KB; GPIO Ports Number: 37; ADC (Units/Channels/bits): 2@x12bit; (E)PWM (Units/Channels/bits): 1@x16bit; 16Bit Timer Number: 3; U(S)ART Number: 3; I2C Number: 2; (Q)SPI Number: 2; CAN Number: 1; USB (H/D/OTG): 全速USB Device; Peripherals / Functions / Protocol Stacks: 片载温度传感器；DMA；看门狗；LIN总线协议；PWM；IrDA；SDIO；RTC实时时钟; Operating Temperature Range: -40~+85
U2 = AMS1117-3.3_C347222: 输出类型:固定;输出极性:正;输出通道数:1;最大输入电压:18V;输出电压:3.3V;压差:1.3V@(1A);输出电流:1A;电源纹波抑制比(PSRR):60dB@(120Hz);; LCSC Part Name: 正 Vin=18V Vout=3.3V 1A 60dB@(120Hz); Supplier Part: C347222; Manufacturer: UMW(广东友台半导体); Supplier Footprint: SOT-223-4; JLCPCB Part Class: Extended Part; Datasheet: https://atta.szlcsc.com/upload/public/pdf/source/20211011/50CC665C22E3A66C08379A4A74BDA25C.pdf; Supplier: LCSC; Output Type: 固定; Output Polarity: 正; Number of Outputs: 1; Maximum Input Voltage: 18V; Output Voltage: 3.3V; Dropout Voltage: 1.3V@(1A); Output Current: 1A; Power Supply Rejection Ratio (PRSS): 60dB@(120Hz); Power Supply Rejection Ratio (PSRR): 60dB@(120Hz)
USB1 = TYPE-C 16PIN 2MD(073): 连接器类型:Type-C;标准:-;公母:母座;触点数量:16;端口数量:1;安装方式:卧贴;额定电流 - 电源:5A;工作温度范围:-25~+85;; LCSC Part Name: Type-C 母座 卧贴 带定位柱 不锈钢外壳 2次模顶; Supplier Part: C2765186; Manufacturer: SHOU HAN(首韩); Supplier Footprint: SMD; JLCPCB Part Class: Extended Part; Datasheet: https://atta.szlcsc.com/upload/public/pdf/source/20211123/39B17C16241EAC15C5E277BDA434118E.pdf; Supplier: LCSC; Connector Type: Type-C; Gender: 母座; Number of Contacts: 16; Number of Ports: 1; Mounting Style: 卧贴; Current Rating - Power (Max): 5A; Operating Temperature Range: -25~+85
X2 = X322512MSB4SI: 晶振类型:贴片无源晶振;频率:12MHz;频率公差:±10ppm;频率稳定度:±30ppm;负载电容:20pF;工作温度:-40℃~+85℃;; LCSC Part Name: 12MHz ±10ppm 20pF; Supplier Part: C9002; Manufacturer: YXC(扬兴晶振); Supplier Footprint: SMD3225-4P; JLCPCB Part Class: Basic Part; Datasheet: https://atta.szlcsc.com/upload/public/pdf/source/20210329/C112971_1F611BDC486E193C1706F6D8EB5AA189.pdf; Supplier: LCSC; Crystal Type: 贴片无源晶振; Frequency Tolerance: ±10ppm; Frequency Stability: ±30ppm; Load Capacitance: 20pF; Operating Temperature: -40℃~+85℃

## Nets
+3.3V: C2.2 C3.2 C4.2 C5.2 C9.1 CN1.1 CN2.4 LED2.2(A) LED3.2(+) R4.2 R5.2 U1.1(VBAT) U1.9(VDDA) U1.24(VDD_1) U1.36(VDD_2) U1.48(VDD_3) U2.2(VOUT(TAB)) U2.4(TAB)
+5V: C8.2 F1.1 U2.3(VIN)
GND: C1.1 C2.1 C3.1 C4.1 C5.1 C6.2 C7.2 C8.1 C9.2 CN1.4 CN2.1 H1.1 LED1.1(K) R6.2 R8.2 R11.2 U1.8(VSSA) U1.23(VSS_1) U1.35(VSS_2) U1.47(VSS_3) U2.1(ADJ(GND)) USB1.1(GND) USB1.12(GND) USB1.13(SHELL) USB1.14(SHELL) X2.2(GND) X2.4(GND)
VBUS: F1.2 USB1.2(VBUS) USB1.11(VBUS)
BOOT0: R11.1 U1.44(BOOT0)
IF_RX: H1.2 U1.31(PA10)
IF_SWCLK: H1.5 U1.37(PA14)
IF_SWDIO: H1.4 U1.34(PA13)
IF_TX: H1.3 U1.30(PA9)
LED_COM_GREEN: R2.2 U1.41(PB5)
LED_DAP_BLUE: R3.2 U1.42(PB6)
LED_PWR_RED: R1.2 U1.43(PB7)
OSCIN: C6.1 U1.5(PD0_OSC_IN) X2.3(OSC2)
OSCOUT: C7.1 U1.6(PD1_OSC_OUT) X2.1(OSC1)
TGT_RX: CN2.2 U1.22(PB11)
TGT_SWCLK: CN1.2 U1.18(PB0)
TGT_SWDIO: CN1.3 R10.2 U1.19(PB1)
TGT_TX: CN2.3 U1.21(PB10)
USB_DM: R9.2 U1.32(PA11)
USB_DP: R5.1 R7.2 U1.33(PA12)
$1N2779: R6.1 USB1.10(CC2)
$1N2780: R8.1 USB1.4(CC1)
$1N2786: R7.1 USB1.6(DP1) USB1.8(DP2)
$1N2787: R9.1 USB1.5(DN2) USB1.7(DN1)
$1N2795: R10.1 U1.20(PB2)
$1N2822: C1.2 R4.1 U1.7(NRST)
$1N2834: LED1.2(A) R1.1
$1N2836: LED2.1(K) R2.1
$1N2839: LED3.1(-) R3.1

Not connected (* = marked no-connect by the designer): U1 2(PC13_TAMPER_RTC) 3(PC14_OSC32_IN) 4(PC15_OSC32_OUT) 10(PA0_WAKEUP) 11(PA1) 12(PA2) 13(PA3) 14(PA4) 15(PA5) 16(PA6) 17(PA7) 25(PB12) 26(PB13) 27(PB14) 28(PB15) 29(PA8) 38(PA15) 39(PB3) 40(PB4) 45(PB8) 46(PB9); USB1 3(SBU2)* 9(SBU1)*

# Board Mini_v1
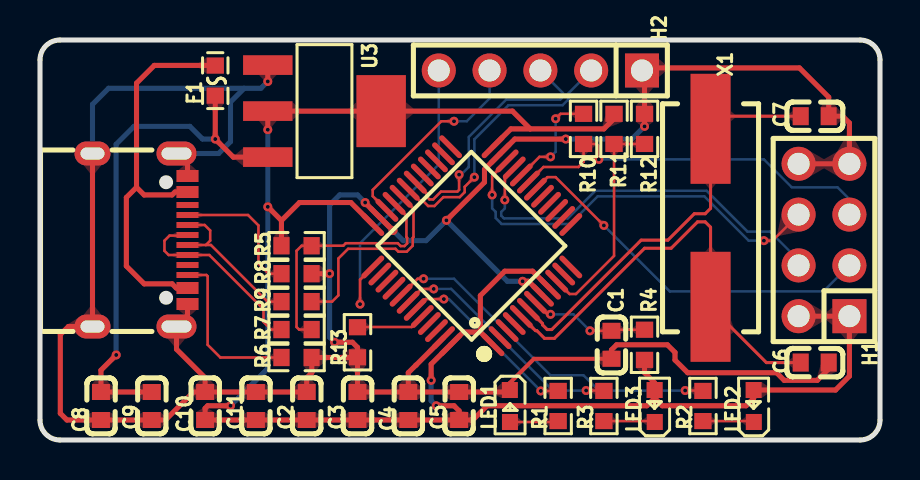
[diagram p2: board, top side]
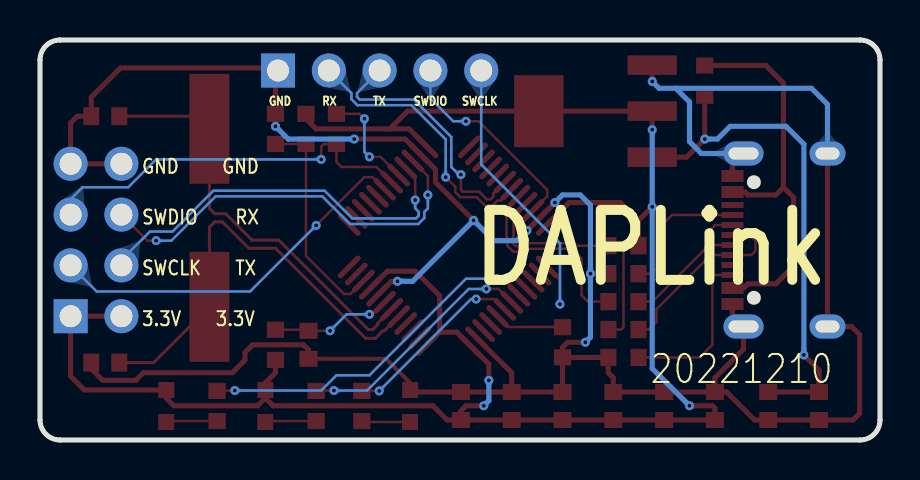
[diagram p3: board, bottom side, seen from below]

Outline 42 x 20 mm; copper layers: Top Layer, Bottom Layer. Coordinates in mm from the lower left corner of the outline.
Outline path: 0,19 0,1 arc(0.29,0.29) 1,0 41,0 arc(41.71,0.29) 42,1 42,19 arc(41.71,19.71) 41,20 1,20 arc(0.29,19.71) 0,19
Stack: Top Layer 0.035mm / Dielectric1 1.51mm FR4 er 4.5 / Bottom Layer 0.035mm

## Design rules (mm)
spacing safeClearance (default): track to track 0.152, other pairs 0.152 to 0.3
track width trackWidth (default): min 0.102, default 0.152, max 0.203
track width PWR: min 0.203, default 0.254, max 2.54
differential pair differentialPair (default): width min 0.127, default 0.254, max 2.54; gap min 0.152, default 0.152
via viaSize (default): diameter min 0.45, default 0.45, max 10; hole min 0.2, default 0.2, max 6
net +5V uses PWR
net +3.3V uses PWR
net GND uses PWR
net VBUS uses PWR

## Placement (name value [footprint] x y rotation side)
C1  100nF  [C0603]  28.57 4.76 90 top
C2  100nF  [C0603]  13.34 1.7 270 top
C3  100nF  [C0603]  15.88 1.7 270 top
C4  100nF  [C0603]  18.41 1.7 270 top
C5  100nF  [C0603]  20.96 1.7 270 top
C6  22pF  [C0603]  38.74 3.87 180 top
C7  22pF  [C0603]  38.74 16.19 180 top
C8  10uF  [C0603]  3.05 1.7 270 top
C9  100nF  [C0603]  5.59 1.7 270 top
C10  100nF  [C0603]  8.25 1.7 270 top
C11  10uF  [C0603]  10.79 1.7 270 top
F1  BSMD0603-050-6V  [F0603]  8.76 17.97 90 top
H1  PZ254V-12-8P  [HDR-TH_8P-P2.54-V-M-R2-C4-S2.54]  39.2 10 90 top
H2  PZ254V-11-05P  [HDR-TH_5P-P2.54-V-M]  25.02 18.48 180 top
LED1  NCD0603R1  [LED0603-RD_RED]  23.5 1.7 270 top
LED2  NCD0603G1  [LED0603-RD]  35.69 1.7 90 top
LED3  NCD0603B1  [LED0603-RD]  30.73 1.7 90 top
R1  470Ω  [R0603]  25.91 1.7 90 top
R2  1.5kΩ  [R0603]  33.15 1.7 270 top
R3  1.5kΩ  [R0603]  28.19 1.7 270 top
R4  100kΩ  [R0603]  30.23 4.76 270 top
R5  1.5kΩ  [R0603]  12.83 9.71 180 top
R6  4.7KΩ  [R0603]  12.83 4.12 0 top
R7  33Ω  [R0603]  12.83 5.52 0 top
R8  4.7KΩ  [R0603]  12.83 8.32 0 top
R9  33Ω  [R0603]  12.83 6.92 0 top
R10  100Ω  [R0603]  27.18 15.56 90 top
R11  4.7KΩ  [R0603]  28.7 15.56 270 top
R12  4.7KΩ  [R0603]  30.23 15.56 270 top
R13  100kΩ  [R0603]  15.88 4.89 270 top
U1  GD32F103CBT6  [LQFP-48_L7.0-W7.0-P0.50-LS9.0-BL]  21.59 9.71 45 top
U3  AMS1117-3.3  [SOT-223-4_L6.5-W3.5-P2.30-LS7.0-BR]  14.22 16.44 180 top
USB1  TYPE-C 16PIN 2MD(073)  [USB-C-SMD_TYPE-C-6PIN-2MD-073]  5 10 270 top
X1  8MHz  [CRYSTAL-SMD_L11.5-W4.8-LS12.7]  33.53 11.11 90 top

## Footprints (pads in the part's own frame, mm; a bottom-side part is the same pattern mirrored in y, then rotated)
C0603
  rect 0.8x0.9 smd: 1(-0.7,0) 2(0.7,0)
CRYSTAL-SMD_L11.5-W4.8-LS12.7
  rect 5.499x1.999 smd: 1(-4.45,0) 2(4.45,0)
F0603
  rect 0.806x0.864 smd: 1(-0.753,0) 2(0.753,0)
HDR-TH_5P-P2.54-V-M
  rect 1.7x1.7 hole 1.1: 1(-5.08,0)
  round 1.7 hole 1.1: 2(-2.54,0) 3(0,0) 4(2.54,0) 5(5.08,0)
HDR-TH_8P-P2.54-V-M-R2-C4-S2.54
  rect 1.7x1.7 hole 1.1: 1(-3.81,-1.27)
  round 1.7 hole 1.1: 2(-3.81,1.27) 3(-1.27,-1.27) 4(-1.27,1.27) 5(1.27,-1.27) 6(1.27,1.27) 7(3.81,-1.27) 8(3.81,1.27)
LED0603-RD
  rect 0.8x0.8 smd: 1(-0.799,-0.004) 2(0.799,0.004)
LED0603-RD_RED
  rect 0.8x0.8 smd: 1(-0.799,-0.004) 2(0.799,0.004)
LQFP-48_L7.0-W7.0-P0.50-LS9.0-BL
  oval 0.27x1.5 smd: 1(-2.75,-4.25) 2(-2.25,-4.25) 3(-1.75,-4.25) 4(-1.25,-4.25) 5(-0.75,-4.25) 6(-0.25,-4.25) 7(0.25,-4.25) 8(0.75,-4.25) 9(1.25,-4.25) 10(1.75,-4.25) 11(2.25,-4.25) 12(2.75,-4.25) 25(2.75,4.25) 26(2.25,4.25) 27(1.75,4.25) 28(1.25,4.25) 29(0.75,4.25) 30(0.25,4.25) 31(-0.25,4.25) 32(-0.75,4.25) 33(-1.25,4.25) 34(-1.75,4.25) 35(-2.25,4.25) 36(-2.75,4.25)
  oval 1.5x0.27 smd: 13(4.25,-2.75) 14(4.25,-2.25) 15(4.25,-1.75) 16(4.25,-1.25) 17(4.25,-0.75) 18(4.25,-0.25) 19(4.25,0.25) 20(4.25,0.75) 21(4.25,1.25) 22(4.25,1.75) 23(4.25,2.25) 24(4.25,2.75) 37(-4.25,2.75) 38(-4.25,2.25) 39(-4.25,1.75) 40(-4.25,1.25) 41(-4.25,0.75) 42(-4.25,0.25) 43(-4.25,-0.25) 44(-4.25,-0.75) 45(-4.25,-1.25) 46(-4.25,-1.75) 47(-4.25,-2.25) 48(-4.25,-2.75)
R0603
  rect 0.806x0.864 smd: 1(-0.753,0) 2(0.753,0)
SOT-223-4_L6.5-W3.5-P2.30-LS7.0-BR
  rect 2.47x0.98 smd: 1(2.835,-2.3) 2(2.835,0) 3(2.835,2.3)
  rect 2.47x3.6 smd: 4(-2.835,0)
USB-C-SMD_TYPE-C-6PIN-2MD-073
  rect 0.6x1.1 smd: 1(-3.2,2.375) 2(-2.4,2.375) 11(2.4,2.375) 12(3.2,2.375)
  rect 0.3x1.1 smd: 3(-1.75,2.375) 4(-1.25,2.375) 5(-0.75,2.375) 6(-0.25,2.375) 7(0.25,2.375) 8(0.75,2.375) 9(1.25,2.375) 10(1.75,2.375)
  oval 1.2x2 hole 0.6x1.5: 13(-4.325,1.825) 14(4.325,1.825)
  oval 1.2x1.8 hole 0.6x1.2: 13(-4.325,-2.375) 14(4.325,-2.375)

## Nets
As in the schematic.

Pads without a net: U1 2 3 4 11 12 13 14 15 16 17 28 29 38 39 40 45 46; USB1 3 9

## Via types
v1: diameter 0.45, hole 0.2, Top Layer to Bottom Layer, 35 vias

## Routing (per net, layer and track width the routed paths; a pad name or vN(x,y) marks a point on that pad's centre or on a via; arc(x,y) is an arc through that point)
+3.3V: length 100.8
  Top Layer w0.254: 12.07,10.97 12.97,11.87 15.54,11.87 U1.36 ; 12.07,10.97 v1(11.39,11.66) ; 12.07,10.97 R5.2 ; 24.51,15.56 23.54,15.56 U1.24 ; 24.51,15.56 28.19,15.56 28.7,16.06 R11.1 ; 24.51,15.56 23.62,16.44 U3.4 U3.2 v1(11.39,15.51) ; C5.2 21.64,1 22.35,1.71 30.35,1.71 30.73,2.1 ; C5.2 C4.2 C3.2 C2.2 C11.2 C10.2 8.25,1.58 8.38,1.71 v1(9.53,1.71) ; C5.2 20.96,1.46 20.7,1.71 v1(19.81,1.71) ; 22.02,5.39 U1.1 ; 22.02,5.39 21.16,5.39 U1.48 19.56,3.79 v1(19.56,2.98) ; 22.02,5.39 22.02,7.22 23.24,8.44 24.63,8.44 U1.9 ; H1.2 H1.1 40.47,3.19 39.78,2.5 LED2.2 35.68,2.09 35.31,1.71 31.12,1.71 30.73,2.1 ; 30.73,2.1 LED3.2 30.73,2.86 30.23,3.36 R4.2
  Bottom Layer w0.254: v1(19.56,2.98) 19.56,1.97 v1(19.81,1.71) ; v1(9.53,1.71) 11.39,3.58 v1(11.39,11.66) v1(11.39,15.51)
+5V: length 26
  Top Layer w0.254: U3.3 9.67,14.14 v1(8.76,15.05) F1.1 ; v1(3.81,4.25) 3.05,3.49 C8.1 C9.1
  Bottom Layer w0.254: v1(8.76,15.05) 8.13,15.05 7.49,15.68 4.7,15.68 3.8,14.79 3.8,4.26 v1(3.81,4.25)
GND: length 143.5
  Top Layer w0.203: LED1.1 23.49,2.85 24.7,4.06 C1.1
  Top Layer w0.254: v1(14.48,8.32) R8.2 ; USB1.13 7.38,13.78 USB1.1 ; v1(26.29,15.05) 23.74,15.05 22.22,13.53 22.22,12.89 v1(20.32,10.98) ; R13.2 15.88,4.63 15.62,4.89 v1(14.73,4.89) ; R13.2 C3.1 C4.1 ; R13.2 15.87,4.12 R6.2 13.59,4.12 13.59,3.36 13.34,3.11 C2.1 C11.1 C10.1 ; LED1.1 23.39,2.4 C5.1 C4.1 ; C1.1 28.57,4.51 28.83,4.76 31.37,4.76 31.75,4.38 31.75,4 32.38,3.36 36.83,3.36 37.21,2.98 38.86,2.98 39.44,3.56 C6.1 ; C4.1 18.41,3.36 18.8,3.74 18.8,3.74 U1.47 ; v1(30.23,15.68) R12.1 30.23,18.35 H2.1 30.23,18.6 37.97,18.6 39.44,17.14 C7.1 40.13,16.19 40.47,15.85 H1.7 H1.8 ; v1(17.65,10.47) 17,11.13 U1.35 16.26,11.86 v1(16.26,11.87) ; U1.8 24.43,7.94 v1(24.13,7.94) ; C10.1 7.67,2.4 6.27,1 C9.2 C8.2 1.35,1 1.02,1.33 1.02,5.27 1.42,5.67 USB1.14 USB1.13 ; C10.1 8.25,3.11 6.82,4.54 USB1.14 7.38,6.22 USB1.12 ; U3.1 v1(11.39,17.93)
  Bottom Layer w0.254: 10.21,17.59 9.53,16.9 9.53,14.92 8.93,14.33 USB1.13 ; 10.21,17.59 3.43,17.59 2.62,16.78 USB1.13 ; 10.21,17.59 11.05,17.59 v1(11.39,17.93) 11.43,17.89 11.43,17.84 ; v1(26.29,15.05) 29.59,15.05 v1(30.23,15.68) ; v1(24.13,7.94) 23.37,7.94 v1(20.32,10.98) 19.3,9.97 18.16,9.97 v1(17.65,10.47) ; v1(16.26,11.87) 15.88,12.25 14.99,12.25 14.48,11.75 v1(14.48,8.32) 14.48,5.14 v1(14.73,4.89)
VBUS: length 19.9
  Top Layer w0.254: 4.83,12.63 4.83,17.84 5.72,18.73 8.75,18.73 F1.2 ; 4.83,12.63 4.32,12.13 4.32,8.7 5.21,7.81 6.6,7.81 6.81,7.6 USB1.11 ; 4.83,12.63 5.21,12.25 6.6,12.25 6.75,12.4 USB1.2
BOOT0: length 3.5
  Top Layer w0.127: U1.44 18.59,5.65 15.88,5.65 R13.1
IF_RX: length 13.8
  Top Layer w0.127: v1(21.72,13.14) 21.23,12.66 21.23,12.39 20.99,12.14 20.17,12.14 19.72,11.7 19.41,11.7 19.14,11.97 18.98,11.97 U1.31
  Bottom Layer w0.127: H2.2 26.43,17.35 26.43,17.04 26.13,16.74 23.43,16.74 21.72,15.03 v1(21.72,13.14)
IF_SWCLK: length 15.4
  Top Layer w0.127: U1.37 16,8.01 v1(16,6.79)
  Bottom Layer w0.127: H2.5 19.94,13.78 16,9.84 v1(16,6.79)
IF_SWDIO: length 10.5
  Top Layer w0.127: U1.34 16.64,12.19 16.64,12.51 20.07,15.94 v1(20.7,15.94)
  Bottom Layer w0.127: H2.4 22.48,17.08 21.34,15.94 v1(20.7,15.94)
IF_TX: length 13.1
  Top Layer w0.127: v1(20.96,13.27) 20.96,12.51 20.87,12.42 20.05,12.42 19.66,12.03 19.47,12.03 19.33,12.17 19.33,12.32 18.76,12.89
  Bottom Layer w0.127: H2.3 26.15,17.35 26.15,17.16 26.01,17.02 23.31,17.02 21.44,15.15 21.44,13.65 21.06,13.27 v1(20.96,13.27)
LED_COM_GREEN: length 17.8
  Top Layer w0.127: R2.1 33.13,2.47 v1(32.26,2.47) ; U1.41 18.88,8.06 v1(19.18,8.06)
  Bottom Layer w0.127: v1(19.18,8.06) 20.7,8.06 25.53,3.24 27.18,3.24 27.94,2.47 v1(32.26,2.47)
LED_DAP_BLUE: length 12.2
  Top Layer w0.127: v1(27.31,2.47) 28.17,2.47 R3.1 ; U1.42 19.08,7.55 v1(19.69,7.55)
  Bottom Layer w0.127: v1(27.31,2.47) 25.64,2.47 20.56,7.55 v1(19.69,7.55)
LED_PWR_RED: length 9.3
  Top Layer w0.127: v1(20.19,7.05) 19.28,7.05 U1.43 ; R1.2 v1(25.04,2.45)
  Bottom Layer w0.127: v1(20.19,7.05) 20.45,7.05 v1(25.04,2.45)
OSCIN: length 22.1
  Top Layer w0.152: C6.2 36.32,3.87 X1.1 33.53,10.64 33.26,10.91 32.88,10.91 31.56,9.59 30.23,9.59 25.72,5.08 25.23,5.08 24.84,5.47 24.77,5.47 U1.5
OSCOUT: length 20.8
  Top Layer w0.152: C7.2 34.16,16.19 X1.2 33.53,11.58 33.26,11.31 32.72,11.31 31.39,9.99 30.06,9.99 25.59,5.52 25.36,5.52 25.13,5.76 25.13,5.82 U1.6
TGT_RX: length 20.5
  Top Layer w0.127: U1.22 22.61,13.2 v1(22.61,12.25) ; v1(36.19,9.97) 36.63,9.97 H1.6
  Bottom Layer w0.127: v1(36.19,9.97) 35.43,9.97 33.22,12.18 27.88,12.18 26.5,10.8 23.08,10.8 22.78,11.1 22.78,11.41 22.61,11.58 v1(22.61,12.25)
TGT_SWCLK: length 18.9
  Top Layer w0.127: v1(28.19,10.73) 25.78,13.14 25.37,13.14 U1.18
  Bottom Layer w0.127: v1(28.19,10.73) 31.5,7.43 39.17,7.43 H1.3
TGT_SWDIO: length 19.7
  Top Layer w0.127: v1(27.94,14.03) 27.94,14.67 27.8,14.8 R10.1 27.18,13.9 26.92,13.65 25.17,13.65 24.42,12.89
  Bottom Layer w0.127: v1(27.94,14.03) 36.19,14.03 37.59,12.63 39.88,12.63 40.47,12.04 H1.5
TGT_TX: length 19.9
  Top Layer w0.127: v1(23.24,12) 23.24,13.13 U1.21
  Bottom Layer w0.127: v1(23.24,12) 23.24,11.58 23.06,11.41 23.06,11.22 23.2,11.08 26.39,11.08 27.77,12.46 33.33,12.46 35.38,10.42 36.51,10.42 37.93,8.99 H1.4
USB_DM: length 10.2
  Top Layer w0.127: U1.32 18.67,11.57 18.67,10.15 18.64,10.11 18.64,9.72 18.34,9.42 17.92,9.42 17.77,9.56 15.41,9.56 14.92,9.07 14.92,7.23 14.6,6.92 R9.2
USB_DP: length 12.7
  Top Layer w0.127: R7.2 12.95,5.52 12.83,5.65 12.83,9.46 13.08,9.71 R5.1 15.16,9.71 15.29,9.84 17.89,9.84 18.03,9.7 18.22,9.7 18.36,9.83 18.36,10.11 18.32,10.15 18.32,11.21 U1.33
WAKEUP: length 11
  Top Layer w0.127: U1.10 26.48,7.3 26.8,7.3 28.7,9.2 R11.2 R12.2
$1N5011: length 8.4
  Top Layer w0.127: USB1.10 8.32,8.25 8.38,8.19 8.38,4.76 9.02,4.12 R6.1
$1N5022: length 7
  Top Layer w0.127: R8.1 11.43,8.32 10.92,8.82 10.92,10.73 10.4,11.25 USB1.4
$1N5569: length 9.6
  Top Layer w0.127: R7.1 11.56,5.52 11.18,5.9 11.18,6.54 8.46,9.25 USB1.8 6.43,9.25 6.22,9.46 6.22,9.97 6.48,10.22 7.35,10.22 USB1.6
$1N5606: length 8
  Top Layer w0.127: 8.29,9.75 USB1.7 ; 8.29,9.75 8.51,9.97 8.51,10.47 8.23,10.75 USB1.5 ; 8.29,9.75 8.55,9.75 11.4,6.89 11.43,6.92 R9.1
$1N7368: length 5.3
  Top Layer w0.127: v1(25.78,16.06) 26.03,16.31 R10.2 ; U1.20 24.97,14.16 v1(25.53,14.16)
  Bottom Layer w0.127: v1(25.53,14.16) 25.78,14.41 v1(25.78,16.06)
$1N11980: length 6.1
  Top Layer w0.127: v1(27.5,5.46) C1.2 28.63,5.51 R4.1 ; U1.7 25.37,6.28 v1(25.53,6.28)
  Bottom Layer w0.127: v1(27.5,5.46) 26.67,6.28 v1(25.53,6.28)
$1N15971: length 2.4
  Top Layer w0.127: LED1.2 25.86,0.9 R1.1
$1N16162: length 2.6
  Top Layer w0.127: R2.2 35.64,0.95 LED2.1
$1N16361: length 2.6
  Top Layer w0.127: LED3.1 30.69,0.95 R3.2

## Copper pours and planes (outline as drawn; the poured copper is in the pictures)
GND on Top Layer: 0,20 42,20 42,0 0,0
GND on Bottom Layer: 0,20 42,20 42,0 0,0

Small or netless copper shapes (teardrops, artwork), in the pictures only: 185 on Top Layer, 47 on Bottom Layer

## Text on the board
Bottom Silkscreen Layer: SWCLK | SWDIO | TX | RX | GND | 3.3V | 20221210 | DAPLink

# Board Mini_v2
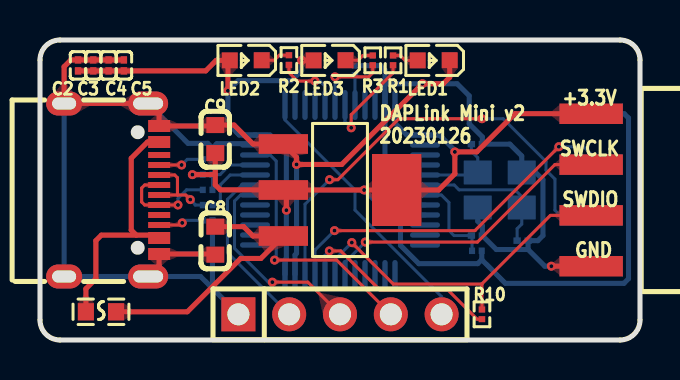
[diagram p4: board, top side]
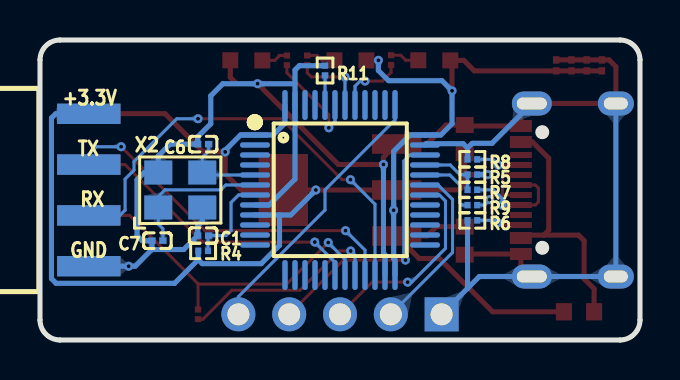
[diagram p5: board, bottom side, seen from below]

Outline 30 x 15 mm; copper layers: Top Layer, Bottom Layer. Coordinates in mm from the lower left corner of the outline.
Outline path: 0,14 0,1 arc(0.29,0.29) 1,0 29,0 arc(29.71,0.29) 30,1 30,14 arc(29.71,14.71) 29,15 1,15 arc(0.29,14.71) 0,14
Stack: Top Layer 0.035mm / Dielectric1 1.51mm FR4 er 4.5 / Bottom Layer 0.035mm

## Design rules (mm)
spacing safeClearance (default): track to track 0.152, other pairs 0.152 to 0.295
track width trackWidth (default): min 0.152, default 0.152, max 0.152
track width PWR: min 0.254, default 0.254, max 0.254
differential pair differentialPair (default): width min 0.127, default 0.254, max 2.54; gap min 0.152, default 0.152
via viaSize (default): diameter min 0.45, default 0.45, max 0.45; hole min 0.2, default 0.2, max 0.2
net +3.3V uses PWR
net GND uses PWR
net VBUS uses PWR
net +5V uses PWR

## Placement (name value [footprint] x y rotation side)
C1  100nF  [C0201]  21.84 5.22 180 bottom
C2  100nF  [C0201]  1.91 13.73 270 top
C3  100nF  [C0201]  2.67 13.73 270 top
C4  100nF  [C0201]  3.43 13.73 270 top
C5  100nF  [C0201]  4.19 13.73 270 top
C6  22pF  [C0201]  21.84 9.79 0 bottom
C7  22pF  [C0201]  24.13 4.97 0 bottom
C8  10uF  [C0603]  8.76 4.97 90 top
C9  10uF  [C0603]  8.76 10.05 90 top
CN1  1125-1104G0Z135CR01  [CONN-SMD_1125-1104G0Z135CR01]  27.56 7.5 270 top
CN2  1125-1104G0Z135CR01  [CONN-SMD_1125-1104G0Z135CR01]  27.56 7.5 90 bottom
F1  BSMD0603-050-6V  [F0603]  3.05 1.41 180 top
H1  PZ254V-11-05P  [HDR-TH_5P-P2.54-V-M]  15 1.28 0 top
LED1  NCD0603R1  [LED0603-RD_RED]  19.69 13.98 180 top
LED2  NCD0603G1  [LED0603-RD]  10.29 13.98 180 top
LED3  NCD0603B1  [LED0603-RD]  14.48 13.98 180 top
R1  0201WMF4700TEE  [R0201]  17.65 13.98 270 top
R2  1.5kΩ  [R0201]  12.45 14 270 top
R3  1.5kΩ  [R0201]  16.64 13.98 270 top
R4  10kΩ  [R0201]  21.84 4.46 0 bottom
R5  1.5kΩ  [R0201]  8.38 8.27 180 bottom
R6  4.7kΩ  [R0201]  8.38 5.98 0 bottom
R7  33Ω  [R0201]  8.38 7.51 0 bottom
R8  4.7kΩ  [R0201]  8.38 9.03 0 bottom
R9  33Ω  [R0201]  8.38 6.75 0 bottom
R10  100Ω  [R0201]  22.1 1.28 90 top
R11  10kΩ  [R0201]  15.75 13.48 90 bottom
U1  GD32F103CBT6  [LQFP-48_L7.0-W7.0-P0.50-LS9.0-BL]  15 7.5 270 bottom
U2  AMS1117-3.3  [SOT-223-4_L6.5-W3.5-P2.30-LS7.0-BR]  15 7.5 180 top
USB1  TYPE-C 16PIN 2MD(073)  [USB-C-SMD_TYPE-C-6PIN-2MD-073]  3.58 7.5 270 top
X2  12MHz  [OSC-SMD_4P-L3.2-W2.5-BL]  22.99 7.5 180 bottom

## Footprints (pads in the part's own frame, mm; a bottom-side part is the same pattern mirrored in y, then rotated)
C0201
  rect 0.368x0.324 smd: 1(-0.275,0) 2(0.275,0)
C0603
  rect 0.8x0.9 smd: 1(-0.7,0) 2(0.7,0)
CONN-SMD_1125-1104G0Z135CR01
  rect 1.02x3.17 smd: 1(-3.81,0) 2(-1.27,0) 3(1.27,0) 4(3.81,0)
F0603
  rect 0.806x0.864 smd: 1(-0.753,0) 2(0.753,0)
HDR-TH_5P-P2.54-V-M
  rect 1.7x1.7 hole 1.1: 1(-5.08,0)
  round 1.7 hole 1.1: 2(-2.54,0) 3(0,0) 4(2.54,0) 5(5.08,0)
LED0603-RD
  rect 0.8x0.8 smd: 1(-0.799,-0.004) 2(0.799,0.004)
LED0603-RD_RED
  rect 0.8x0.8 smd: 1(-0.799,-0.004) 2(0.799,0.004)
LQFP-48_L7.0-W7.0-P0.50-LS9.0-BL
  oval 0.27x1.5 smd: 1(-2.75,-4.25) 2(-2.25,-4.25) 3(-1.75,-4.25) 4(-1.25,-4.25) 5(-0.75,-4.25) 6(-0.25,-4.25) 7(0.25,-4.25) 8(0.75,-4.25) 9(1.25,-4.25) 10(1.75,-4.25) 11(2.25,-4.25) 12(2.75,-4.25) 25(2.75,4.25) 26(2.25,4.25) 27(1.75,4.25) 28(1.25,4.25) 29(0.75,4.25) 30(0.25,4.25) 31(-0.25,4.25) 32(-0.75,4.25) 33(-1.25,4.25) 34(-1.75,4.25) 35(-2.25,4.25) 36(-2.75,4.25)
  oval 1.5x0.27 smd: 13(4.25,-2.75) 14(4.25,-2.25) 15(4.25,-1.75) 16(4.25,-1.25) 17(4.25,-0.75) 18(4.25,-0.25) 19(4.25,0.25) 20(4.25,0.75) 21(4.25,1.25) 22(4.25,1.75) 23(4.25,2.25) 24(4.25,2.75) 37(-4.25,2.75) 38(-4.25,2.25) 39(-4.25,1.75) 40(-4.25,1.25) 41(-4.25,0.75) 42(-4.25,0.25) 43(-4.25,-0.25) 44(-4.25,-0.75) 45(-4.25,-1.25) 46(-4.25,-1.75) 47(-4.25,-2.25) 48(-4.25,-2.75)
OSC-SMD_4P-L3.2-W2.5-BL
  rect 1.4x1.2 smd: 1(-1.1,-0.875) 2(1.1,-0.875) 3(1.1,0.875) 4(-1.1,0.875)
R0201
  rect 0.303x0.324 smd: 1(-0.241,0) 2(0.241,0)
SOT-223-4_L6.5-W3.5-P2.30-LS7.0-BR
  rect 2.47x0.98 smd: 1(2.835,-2.3) 2(2.835,0) 3(2.835,2.3)
  rect 2.47x3.6 smd: 4(-2.835,0)
USB-C-SMD_TYPE-C-6PIN-2MD-073
  rect 0.6x1.1 smd: 1(-3.2,2.375) 2(-2.4,2.375) 11(2.4,2.375) 12(3.2,2.375)
  rect 0.3x1.1 smd: 3(-1.75,2.375) 4(-1.25,2.375) 5(-0.75,2.375) 6(-0.25,2.375) 7(0.25,2.375) 8(0.75,2.375) 9(1.25,2.375) 10(1.75,2.375)
  oval 1.2x2 hole 0.6x1.5: 13(-4.325,1.825) 14(4.325,1.825)
  oval 1.2x1.8 hole 0.6x1.2: 13(-4.325,-2.375) 14(4.325,-2.375)

## Nets
As in the schematic.

Pads without a net: U1 2 3 4 10 11 12 13 14 15 16 17 25 26 27 28 29 38 39 40 45 46; USB1 3 9

## Via types
v1: diameter 0.45, hole 0.2, Top Layer to Bottom Layer, 25 vias

## Routing (per net, layer and track width the routed paths; a pad name or vN(x,y) marks a point on that pad's centre or on a via; arc(x,y) is an arc through that point)
+3.3V: length 83.9
  Top Layer w0.254: U2.2 12.32,7.35 v1(12.32,6.49) ; U2.2 12.16,7.51 9.02,7.51 8.76,7.76 8.76,8.27 ; U2.2 v1(16.21,7.5) U2.4 19.93,7.5 20.74,8.31 v1(20.74,9.41) 21.84,9.41 23.75,11.32 27.55,11.32 CN1.1 ; v1(13.08,13.98) 13.08,13.98 LED3.2 ; v1(9.4,12.46) 9.4,13.89 LED2.2 8.81,13.98 8.29,13.46 C5.2 C4.2 C3.2 C2.2 ; 8.76,8.27 8.76,8.27 v1(7.62,8.27) ; 8.76,8.27 C9.1
  Bottom Layer w0.254: 10.75,10.25 11.5,10.25 12.32,9.43 v1(12.32,6.49) 12.32,4.08 12.25,4.01 12.25,3.25 ; CN1.1 29.22,11.31 29.43,11.1 29.43,3.07 29.19,2.83 23.27,2.83 22.09,4.02 ; v1(13.08,13.98) 13.08,13.48 12.57,12.97 9.91,12.97 v1(9.4,12.46) 9.4,10.81 9.96,10.25 U1.36 ; R5.2 v1(7.62,8.27) ; U1.48 17.75,10.84 18.34,10.25 U1.1 ; v1(20.74,9.41) 20.74,9.48 19.97,10.25 19.25,10.25 ; 19.25,6.25 18.02,6.25 ; 18.02,6.25 18.02,4.73 18.94,3.82 21.88,3.82 22.09,4.02 ; 18.02,6.25 17.46,6.25 v1(16.21,7.5) ; R4.2 22.09,4.02
+5V: length 13.5
  Top Layer w0.254: 8.76,5.67 10.18,5.67 10.65,5.2 U2.3 11.04,4.08 10.03,4.08 7.37,1.41 F1.1
GND: length 101.6
  Top Layer w0.254: C2.1 1.54,14 1.21,13.67 1.21,11.83 1.21,11.83 5.4,11.83 5.41,11.83 5.96,11.28 USB1.1 8.72,10.7 8.76,10.75 9.7,10.75 10.65,9.8 U2.1 ; C8.1 8.73,4.3 USB1.12 5.96,3.72 USB1.14 ; 4.19,14.01 1.91,14.01 ; v1(25.57,3.69) CN1.4 ; 12.17,9.8 12.83,9.14 v1(12.83,8.78) 15.08,8.78 v1(19.12,12.81) 20.17,12.81 20.48,13.13 LED1.1
  Bottom Layer w0.254: X2.4 24.79,8.38 25.15,8.02 25.15,5.22 24.89,4.97 C7.2 24.4,4.53 ; 17.25,12.81 v1(19.12,12.81) 20.85,12.81 21.46,12.21 21.46,10.81 22.12,10.15 C6.2 23.5,9.79 24.09,9.2 24.09,8.37 ; 17.25,12.81 17.25,13.5 17.03,13.72 R11.2 ; 17.25,12.81 17.25,8.04 18.54,6.75 19.25,6.75 ; 24.4,4.53 24.4,4.52 22.82,4.52 22.12,5.22 22.12,5.71 21.89,5.94 X2.2 ; 24.4,4.53 25.24,3.69 v1(25.57,3.69) CN1.4 ; 8.62,2.58 H1.1 ; 8.62,2.58 R6.2 ; 8.62,2.58 8.03,3.17 USB1.14 ; USB1.13 USB1.14 5.41,3.17 ; U1.23 12.75,4.25 12.83,4.33 v1(12.83,8.78) ; 8.62,9.6 8.39,9.83 7.4,9.83 5.41,11.83 ; 8.62,9.6 R8.2 ; 8.62,9.6 8.84,9.82 10.68,9.82 10.75,9.75
VBUS: length 12.8
  Top Layer w0.254: USB1.2 5.38,9.9 4.56,9.09 4.56,5.5 4.82,5.24 ; 4.82,5.24 5.81,5.24 USB1.11 ; 4.82,5.24 3.07,5.24 2.79,4.97 2.79,3.06 2.29,2.56 F1.2
BOOT0: length 1.5
  Bottom Layer w0.152: U1.44 15.75,11.75 R11.1
IF_RX: length 8.7
  Bottom Layer w0.152: U1.31 10.09,7.75 9.37,7.03 9.37,4.37 H1.2
IF_SWCLK: length 13.7
  Bottom Layer w0.152: U1.37 12.25,11 15.75,7.5 15.75,6.5 20.08,2.17 H1.5
IF_SWDIO: length 13.1
  Top Layer w0.152: v1(11.73,4) 14.83,4 H1.4
  Bottom Layer w0.152: v1(11.73,4) 11.81,4.08 11.81,8.95 11.51,9.25 U1.34
IF_TX: length 10.2
  Top Layer w0.152: H1.3 13.39,2.89 v1(11.62,2.89)
  Bottom Layer w0.152: 10.75,7.25 10.03,7.25 9.73,6.95 9.73,4.58 11.41,2.89 v1(11.62,2.89)
LED_COM_GREEN: length 3.4
  Top Layer w0.152: 12.45,13.75 12.45,13.37 12.87,12.95 v1(13.75,12.95)
  Bottom Layer w0.152: v1(13.75,12.95) 13.99,12.95 14.25,12.69 U1.41
LED_DAP_BLUE: length 3.8
  Top Layer w0.152: v1(14.75,13.16) 16.44,13.16 16.64,13.36 R3.2
  Bottom Layer w0.152: U1.42 v1(14.75,13.16)
LED_PWR_RED: length 5.3
  Top Layer w0.152: v1(15.56,10.61) 15.56,11.27 17.65,13.36 R1.2
  Bottom Layer w0.152: v1(15.56,10.61) 15.25,10.92 U1.43
OSCIN: length 4.2
  Bottom Layer w0.152: C6.1 21.57,9.43 21.89,9.11 X2.3 21.76,8.25 U1.5
OSCOUT: length 7.4
  Bottom Layer w0.152: U1.6 20.71,7.75 20.96,7.51 23.75,7.51 24.09,7.17 X2.1 24.09,5.8 23.86,5.56 C7.1
TGT_RX: length 22.8
  Top Layer w0.152: v1(22.1,11.06) 17.94,11.06 14.89,8.02 v1(14.48,8.02)
  Bottom Layer w0.152: v1(14.48,8.02) 13.25,6.79 13.25,3.25 ; CN2.2 26.01,6.23 25.75,6.49 25.75,8.04 25.3,8.49 25.3,8.92 23.16,11.06 v1(22.1,11.06)
TGT_SWCLK: length 15
  Top Layer w0.152: v1(16.26,4.9) 21.87,4.9 25.75,8.77 CN1.2
  Bottom Layer w0.152: 15.25,3.25 15.25,3.88 v1(16.26,4.9)
TGT_SWDIO: length 17.5
  Top Layer w0.152: 22.1,2.8 R10.2 ; 22.1,2.8 22.1,2.81 25.52,6.23 CN1.3 ; 22.1,2.8 17.67,2.8 v1(15.59,4.87)
  Bottom Layer w0.152: 14.75,3.25 14.75,4.03 v1(15.59,4.87)
TGT_TX: length 17.9
  Top Layer w0.152: v1(25.94,9.66) 21.75,5.47 v1(14.72,5.47)
  Bottom Layer w0.152: 27.18,9.67 27.56,9.28 CN2.3 ; v1(25.94,9.66) 27.18,9.66 ; 13.75,3.25 13.75,4.49 v1(14.72,5.47)
USB_DM: length 3.3
  Bottom Layer w0.152: R9.2 8.89,6.75 9.02,6.87 9.02,7.76 9.51,8.25 U1.32
USB_DP: length 3.1
  Bottom Layer w0.152: R7.2 8.62,8.27 9,8.27 9.48,8.75 U1.33
$1N2779: length 2.3
  Top Layer w0.152: v1(7.11,5.86) 7.01,5.75 USB1.10
  Bottom Layer w0.152: R6.1 7.24,5.98 v1(7.11,5.86)
$1N2780: length 2.3
  Top Layer w0.152: v1(7.08,8.75) USB1.4
  Bottom Layer w0.152: R8.1 7.36,9.03 v1(7.08,8.75)
$1N2786: length 5.3
  Top Layer w0.152: v1(6.9,6.75) 5.23,6.75 5.08,6.9 5.08,7.6 5.23,7.75 USB1.6
  Bottom Layer w0.152: v1(6.9,6.75) 6.9,7.08 7.33,7.51 R7.1
$1N2787: length 4.2
  Top Layer w0.152: 6.87,7.25 6.87,8.11 6.74,8.25 USB1.5 ; 6.87,7.25 5.96,7.25 ; 6.87,7.25 7.28,7.25 v1(7.51,7.02)
  Bottom Layer w0.152: 8.14,6.75 7.76,6.75 7.76,6.77 v1(7.51,7.02)
$1N2795: length 10.3
  Top Layer w0.152: v1(14.47,4.45) 15.04,4.45 17,2.49 20.41,2.49 21.85,1.04 R10.1
  Bottom Layer w0.152: 14.25,3.25 14.25,4.23 v1(14.47,4.45)
$1N2822: length 4.8
  Bottom Layer w0.152: C1.2 21.6,5.19 R4.1 ; 21.57,5.22 20.7,5.22 20.45,5.47 20.45,6.87 20.07,7.25 U1.7
$1N2834: length 1.4
  Top Layer w0.152: R1.1 18.04,14.23 18.04,14.19 18.26,13.98 18.88,13.98
$1N2836: length 1.5
  Top Layer w0.152: 11.09,13.99 11.71,13.99 11.97,14.24 12.45,14.24
$1N2839: length 1.5
  Top Layer w0.152: R3.1 16.14,14.23 15.91,13.99 LED3.1

## Copper pours and planes (outline as drawn; the poured copper is in the pictures)
GND on Top Layer: 0,15 30,15 30,0 0,0
GND on Bottom Layer: 0,15 30,15 30,0 0,0

Small or netless copper shapes (teardrops, artwork), in the pictures only: 94 on Top Layer, 99 on Bottom Layer

## Text on the board
Bottom Silkscreen Layer: RX | TX | GND | +3.3V
Top Silkscreen Layer: DAPLink Mini v2 / 20230126 | SWCLK | +3.3V | SWDIO | GND
